# EAGLE design lupa-hdmi-carrier (EAGLE 9.0.1)

## Sheet 1 of 5: berstak
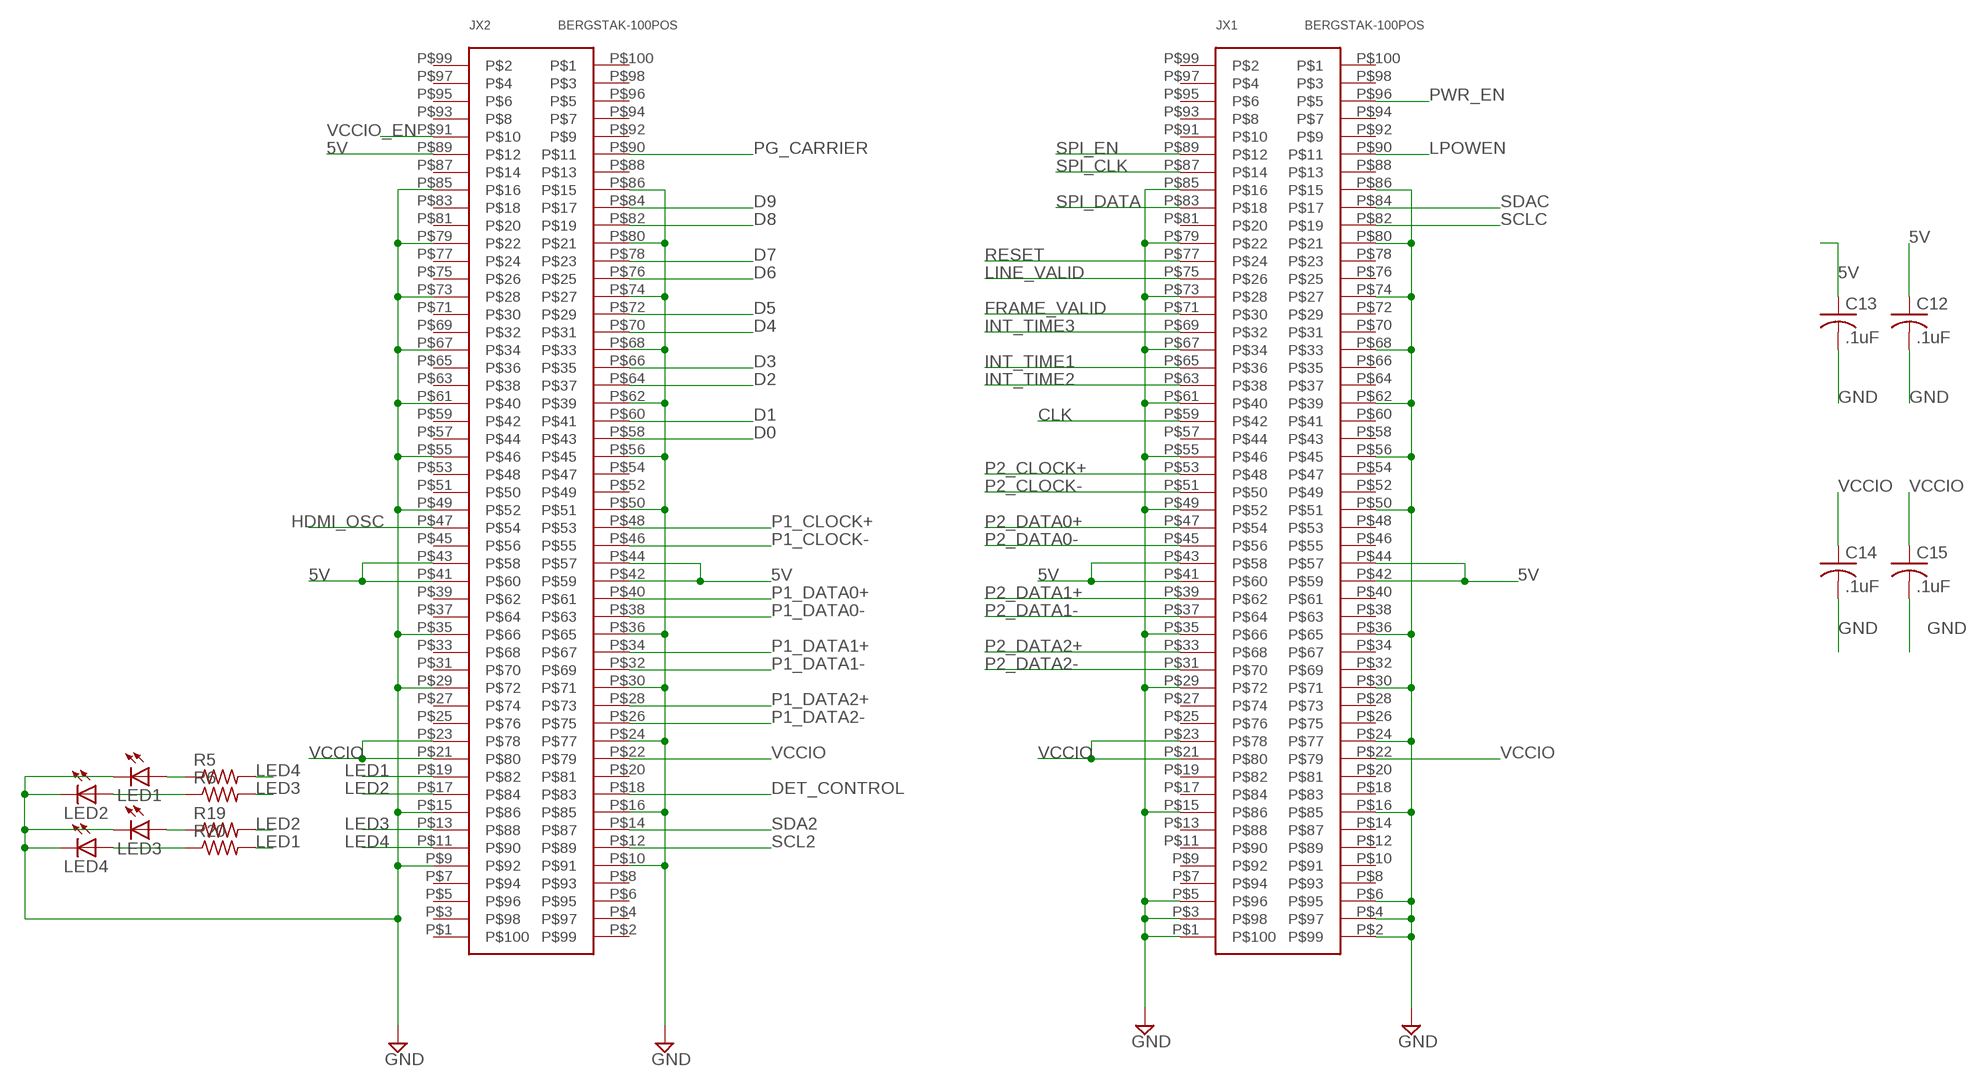
[diagram p0: schematic, sheet 1]

### Parts
C12  .1uF  C-USC0603  [C0603]
C13  .1uF  C-USC0603  [C0603]
C14  .1uF  C-USC0603  [C0603]
C15  .1uF  C-USC0603  [C0603]
JX1  BERGSTAK-100POS  [BERG100POS]
JX2  BERGSTAK-100POS  [BERG100POS]
LED1  LEDCHIPLED_0805  [CHIPLED_0805]
LED2  LEDCHIPLED_0805  [CHIPLED_0805]
LED3  LEDCHIPLED_0805  [CHIPLED_0805]
LED4  LEDCHIPLED_0805  [CHIPLED_0805]
R5  R-US_R0603  [R0603]
R6  R-US_R0603  [R0603]
R19  R-US_R0603  [R0603]
R20  R-US_R0603  [R0603]

### Nets
5V: C12.1 C13.1 JX1.P$41 JX1.P$42 JX1.P$43 JX1.P$44 JX2.P$41 JX2.P$42 JX2.P$43 JX2.P$44 JX2.P$89 ; also sheet 2,4,5
CLK: JX1.P$59 ; also sheet 3
D0: JX2.P$58 ; also sheet 3
D1: JX2.P$60 ; also sheet 3
D2: JX2.P$64 ; also sheet 3
D3: JX2.P$66 ; also sheet 3
D4: JX2.P$70 ; also sheet 3
D5: JX2.P$72 ; also sheet 3
D6: JX2.P$76 ; also sheet 3
D7: JX2.P$78 ; also sheet 3
D8: JX2.P$82 ; also sheet 3
D9: JX2.P$84 ; also sheet 3
DET_CONTROL: JX2.P$18 ; also sheet 5
FRAME_VALID: JX1.P$71 ; also sheet 3
GND: C12.2 C13.2 C14.2 C15.2 JX1.P$1 JX1.P$2 JX1.P$3 JX1.P$4 JX1.P$5 JX1.P$6 JX1.P$15 JX1.P$16 JX1.P$24 JX1.P$29 JX1.P$30 JX1.P$35 JX1.P$36 JX1.P$49 JX1.P$50 JX1.P$55 JX1.P$56 JX1.P$61 JX1.P$62 JX1.P$67 JX1.P$68 JX1.P$73 JX1.P$74 JX1.P$79 JX1.P$80 JX1.P$85 JX1.P$86 JX2.P$9 JX2.P$10 JX2.P$15 JX2.P$16 JX2.P$24 JX2.P$29 JX2.P$30 JX2.P$35 JX2.P$36 JX2.P$49 JX2.P$50 JX2.P$55 JX2.P$56 JX2.P$61 JX2.P$62 JX2.P$67 JX2.P$68 JX2.P$73 JX2.P$74 JX2.P$79 JX2.P$80 JX2.P$85 JX2.P$86 LED1.C LED2.C LED3.C LED4.C ; also sheet 2,3,4,5
HDMI_OSC: JX2.P$47 ; also sheet 5
INT_TIME1: JX1.P$65 ; also sheet 3
INT_TIME2: JX1.P$63 ; also sheet 3
INT_TIME3: JX1.P$69 ; also sheet 3
LED1: JX2.P$19 R20.2
LED2: JX2.P$17 R19.2
LED3: JX2.P$13 R6.2
LED4: JX2.P$11 R5.2
LINE_VALID: JX1.P$75 ; also sheet 3
LPOWEN: JX1.P$90 ; also sheet 4
N$3: LED1.A R5.1
N$13: LED2.A R6.1
N$15: LED3.A R19.1
N$16: LED4.A R20.1
P1_CLOCK+: JX2.P$48 ; also sheet 5
P1_CLOCK-: JX2.P$46 ; also sheet 5
P1_DATA0+: JX2.P$40 ; also sheet 5
P1_DATA0-: JX2.P$38 ; also sheet 5
P1_DATA1+: JX2.P$34 ; also sheet 5
P1_DATA1-: JX2.P$32 ; also sheet 5
P1_DATA2+: JX2.P$28 ; also sheet 5
P1_DATA2-: JX2.P$26 ; also sheet 5
P2_CLOCK+: JX1.P$53 ; also sheet 5
P2_CLOCK-: JX1.P$51 ; also sheet 5
P2_DATA0+: JX1.P$47 ; also sheet 5
P2_DATA0-: JX1.P$45 ; also sheet 5
P2_DATA1+: JX1.P$39 ; also sheet 5
P2_DATA1-: JX1.P$37 ; also sheet 5
P2_DATA2+: JX1.P$33 ; also sheet 5
P2_DATA2-: JX1.P$31 ; also sheet 5
PG_CARRIER: JX2.P$90
PWR_EN: JX1.P$96 ; also sheet 2
RESET: JX1.P$77 ; also sheet 3
SCL2: JX2.P$12 ; also sheet 5
SCLC: JX1.P$82 ; also sheet 5
SDA2: JX2.P$14 ; also sheet 5
SDAC: JX1.P$84 ; also sheet 5
SPI_CLK: JX1.P$87 ; also sheet 3
SPI_DATA: JX1.P$83 ; also sheet 3
SPI_EN: JX1.P$89 ; also sheet 3
VCCIO: C14.1 C15.1 JX1.P$21 JX1.P$22 JX1.P$23 JX2.P$21 JX2.P$22 JX2.P$23 ; also sheet 2,3,5
VCCIO_EN: JX2.P$91 ; also sheet 2
Unconnected: JX1.P$7 JX1.P$8 JX1.P$9 JX1.P$10 JX1.P$11 JX1.P$12 JX1.P$13 JX1.P$14 JX1.P$17 JX1.P$18 JX1.P$19 JX1.P$20 JX1.P$25 JX1.P$26 JX1.P$27 JX1.P$28 JX1.P$32 JX1.P$34 JX1.P$38 JX1.P$40 JX1.P$46 JX1.P$48 JX1.P$52 JX1.P$54 JX1.P$57 JX1.P$58 JX1.P$60 JX1.P$64 JX1.P$66 JX1.P$70 JX1.P$72 JX1.P$76 JX1.P$78 JX1.P$81 JX1.P$88 JX1.P$91 JX1.P$92 JX1.P$93 JX1.P$94 JX1.P$95 JX1.P$97 JX1.P$98 JX1.P$99 JX1.P$100 JX2.P$1 JX2.P$2 JX2.P$3 JX2.P$4 JX2.P$5 JX2.P$6 JX2.P$7 JX2.P$8 JX2.P$20 JX2.P$25 JX2.P$27 JX2.P$31 JX2.P$33 JX2.P$37 JX2.P$39 JX2.P$45 JX2.P$51 JX2.P$52 JX2.P$53 JX2.P$54 JX2.P$57 JX2.P$59 JX2.P$63 JX2.P$65 JX2.P$69 JX2.P$71 JX2.P$75 JX2.P$77 JX2.P$81 JX2.P$83 JX2.P$87 JX2.P$88 JX2.P$92 JX2.P$93 JX2.P$94 JX2.P$95 JX2.P$96 JX2.P$97 JX2.P$98 JX2.P$99 JX2.P$100

## Sheet 2 of 5: carrier power
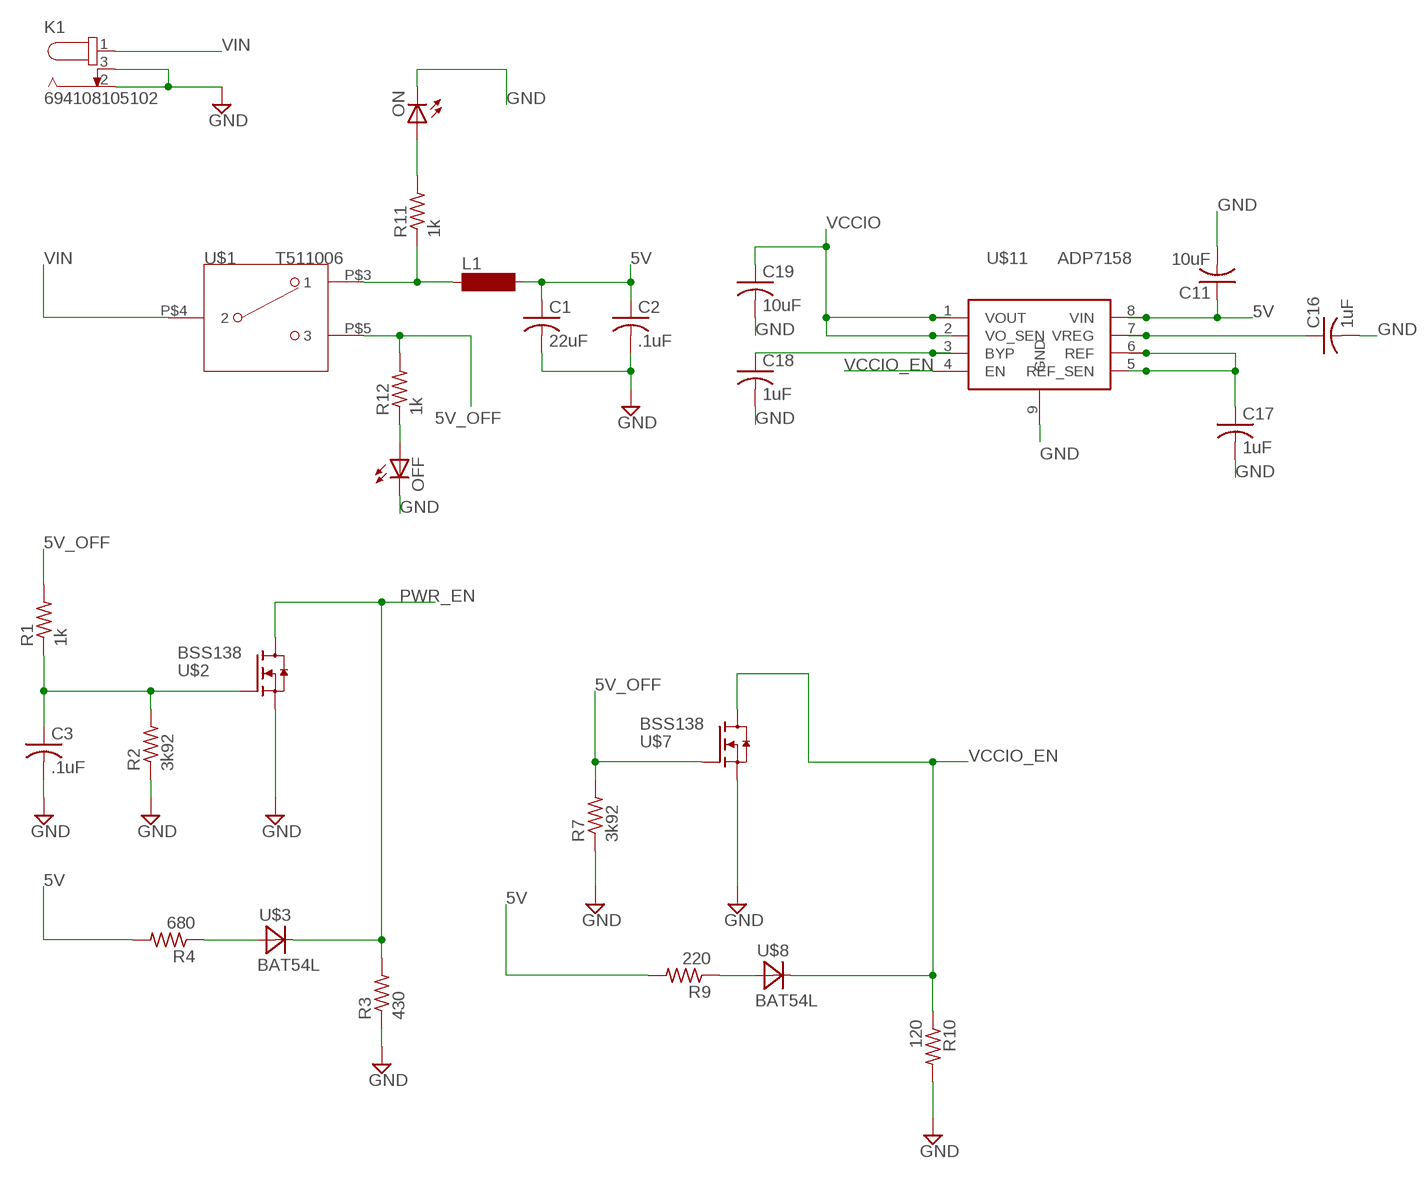
[diagram p1: schematic, sheet 2]

### Parts
C1  22uF  C-USC1206  [C1206]
C2  .1uF  C-USC0603  [C0603]
C3  .1uF  C-USC0603  [C0603]
C11  10uF  C-USC0603  [C0603]
C16  1uF  C-USC0603  [C0603]
C17  1uF  C-USC0603  [C0603]
C18  1uF  C-USC0603  [C0603]
C19  10uF  C-USC0603  [C0603]
K1  694108105102  [694108105102]
L1  MS85  [MS85]
OFF  LEDCHIPLED_0805  [CHIPLED_0805]
ON  LEDCHIPLED_0805  [CHIPLED_0805]
R1  1k  R-US_R0603  [R0603]
R2  3k92  R-US_R0603  [R0603]
R3  430  R-US_R0603  [R0603]
R4  680  R-US_R0603  [R0603]
R7  3k92  R-US_R0603  [R0603]
R9  220  R-US_R0603  [R0603]
R10  120  R-US_R0603  [R0603]
R11  1k  R-US_R0603  [R0603]
R12  1k  R-US_R0603  [R0603]
U$1  T511006  [SPDT]
U$2  BSS138  [SOT23]
U$3  BAT54L  [SOT23]
U$7  BSS138  [SOT23]
U$8  BAT54L  [SOT23]
U$11  ADP7158  [SO08]

### Nets
5V: C1.1 C2.1 C11.1 L1.2 R4.2 R9.2 U$11.8(VIN) ; also sheet 1,4,5
5V_OFF: R1.2 R7.2 R12.2 U$1.P$5 U$7.1(G)
GND: C1.2 C2.2 C3.2 C11.2 C16.2 C17.2 C18.2 C19.2 K1.2 K1.3 OFF.C ON.C R2.1 R3.1 R7.1 R10.2 U$2.2(S) U$7.2(S) U$11.9(GND) ; also sheet 1,3,4,5
N$1: C3.1 R1.1 R2.2 U$2.1(G)
N$4: R4.1 U$3.1(A)
N$5: ON.A R11.2
N$7: L1.1 R11.1 U$1.P$3
N$8: R9.1 U$8.1(A)
N$10: C16.1 U$11.7(VREG)
N$11: C17.1 U$11.5(REF_SEN) U$11.6(REF)
N$12: C18.1 U$11.3(BYP)
N$24: OFF.A R12.1
PWR_EN: R3.2 U$2.3(D) U$3.3(C) ; also sheet 1
VCCIO: C19.1 U$11.1(VOUT) U$11.2(VO_SEN) ; also sheet 1,3,5
VCCIO_EN: R10.1 U$7.3(D) U$8.3(C) U$11.4(EN) ; also sheet 1
VIN: K1.1 U$1.P$4

## Sheet 3 of 5: lupa300
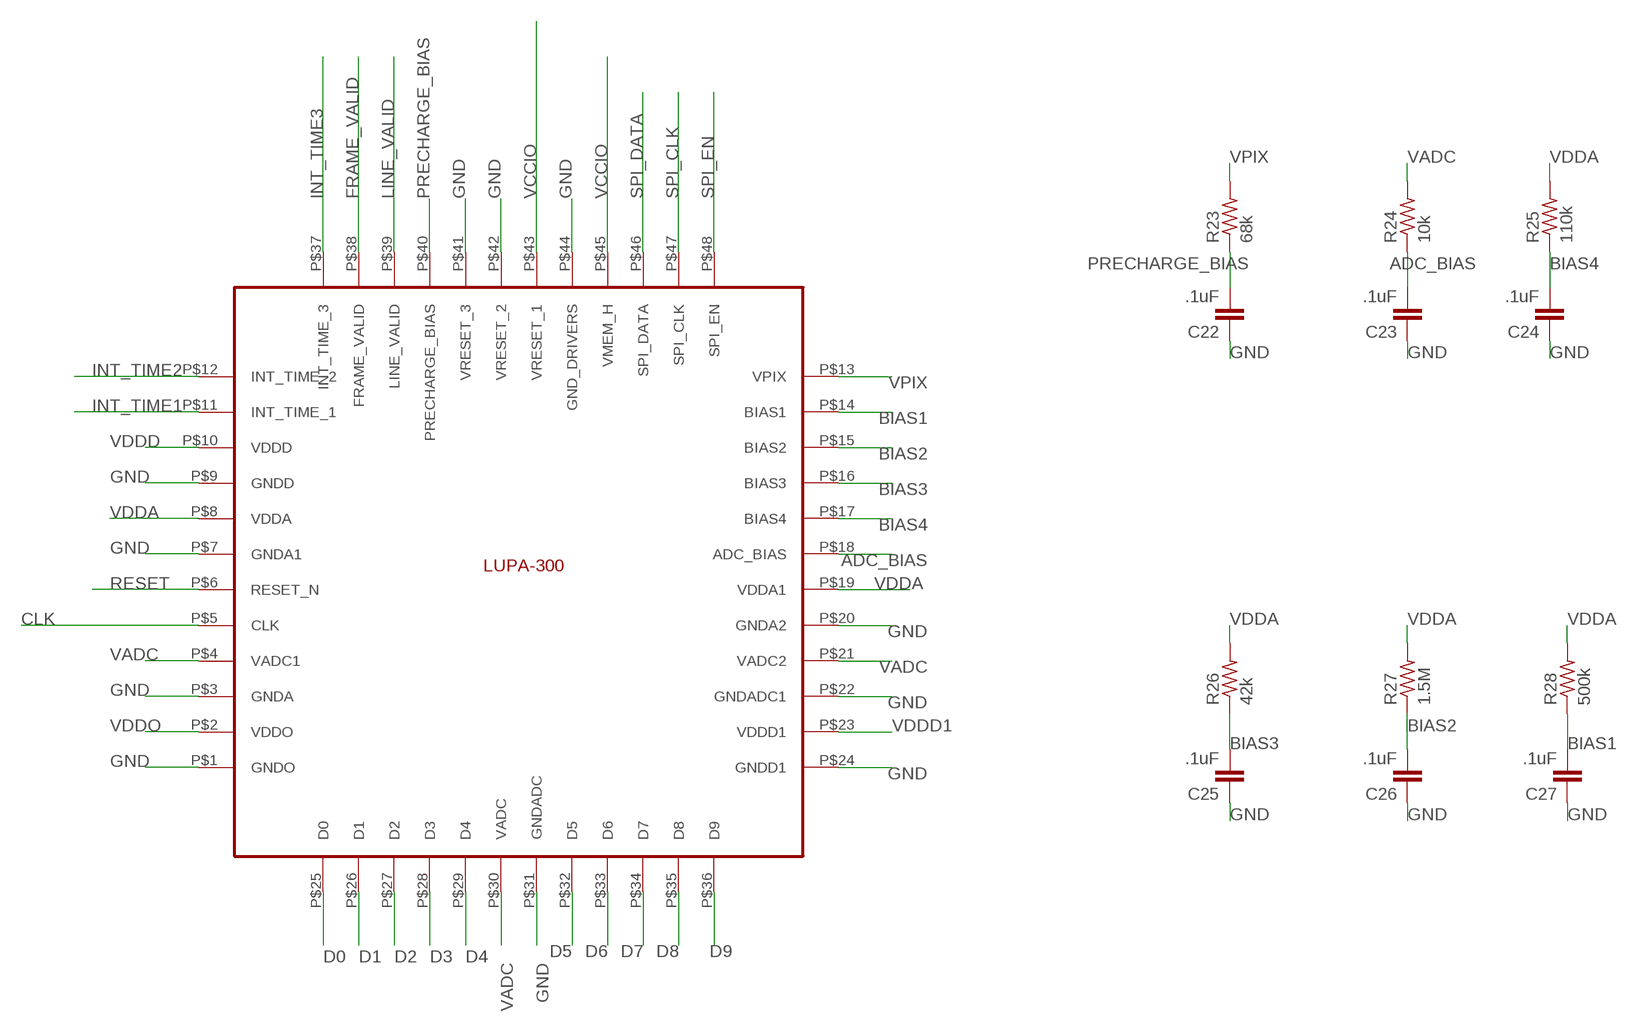
[diagram p2: schematic, sheet 3]

### Parts
C22  .1uF  C-EUC0603  [C0603]
C23  .1uF  C-EUC0603  [C0603]
C24  .1uF  C-EUC0603  [C0603]
C25  .1uF  C-EUC0603  [C0603]
C26  .1uF  C-EUC0603  [C0603]
C27  .1uF  C-EUC0603  [C0603]
R23  68k  R-US_R0603  [R0603]
R24  10k  R-US_R0603  [R0603]
R25  110k  R-US_R0603  [R0603]
R26  42k  R-US_R0603  [R0603]
R27  1.5M  R-US_R0603  [R0603]
R28  500k  R-US_R0603  [R0603]
U$4  LUPA300  [LUPA300]

### Nets
ADC_BIAS: C23.2 R24.1 U$4.P$18(ADC_BIAS)
BIAS1: C27.2 R28.1 U$4.P$14(BIAS1)
BIAS2: C26.2 R27.1 U$4.P$15(BIAS2)
BIAS3: C25.2 R26.1 U$4.P$16(BIAS3)
BIAS4: C24.2 R25.1 U$4.P$17(BIAS4)
CLK: U$4.P$5(CLK) ; also sheet 1
D0: U$4.P$25(D0) ; also sheet 1
D1: U$4.P$26(D1) ; also sheet 1
D2: U$4.P$27(D2) ; also sheet 1
D3: U$4.P$28(D3) ; also sheet 1
D4: U$4.P$29(D4) ; also sheet 1
D5: U$4.P$32(D5) ; also sheet 1
D6: U$4.P$33(D6) ; also sheet 1
D7: U$4.P$34(D7) ; also sheet 1
D8: U$4.P$35(D8) ; also sheet 1
D9: U$4.P$36(D9) ; also sheet 1
FRAME_VALID: U$4.P$38(FRAME_VALID) ; also sheet 1
GND: C22.1 C23.1 C24.1 C25.1 C26.1 C27.1 U$4.P$1(GNDO) U$4.P$3(GNDA) U$4.P$7(GNDA1) U$4.P$9(GNDD) U$4.P$20(GNDA2) U$4.P$22(GNDADC1) U$4.P$24(GNDD1) U$4.P$31(GNDADC) U$4.P$41(VRESET_3) U$4.P$42(VRESET_2) U$4.P$44(GND_DRIVERS) ; also sheet 1,2,4,5
INT_TIME1: U$4.P$11(INT_TIME_1) ; also sheet 1
INT_TIME2: U$4.P$12(INT_TIME_2) ; also sheet 1
INT_TIME3: U$4.P$37(INT_TIME_3) ; also sheet 1
LINE_VALID: U$4.P$39(LINE_VALID) ; also sheet 1
PRECHARGE_BIAS: C22.2 R23.1 U$4.P$40(PRECHARGE_BIAS)
RESET: U$4.P$6(RESET_N) ; also sheet 1
SPI_CLK: U$4.P$47(SPI_CLK) ; also sheet 1
SPI_DATA: U$4.P$46(SPI_DATA) ; also sheet 1
SPI_EN: U$4.P$48(SPI_EN) ; also sheet 1
VADC: R24.2 U$4.P$4(VADC1) U$4.P$21(VADC2) U$4.P$30(VADC) ; also sheet 4
VCCIO: U$4.P$43(VRESET_1) U$4.P$45(VMEM_H) ; also sheet 1,2,5
VDDA: R25.2 R26.2 R27.2 R28.2 U$4.P$8(VDDA) U$4.P$19(VDDA1) ; also sheet 4
VDDD: U$4.P$10(VDDD) ; also sheet 4
VDDD1: U$4.P$23(VDDD1) ; also sheet 4
VDDO: U$4.P$2(VDDO) ; also sheet 4
VPIX: R23.2 U$4.P$13(VPIX) ; also sheet 4

## Sheet 4 of 5: lupa power
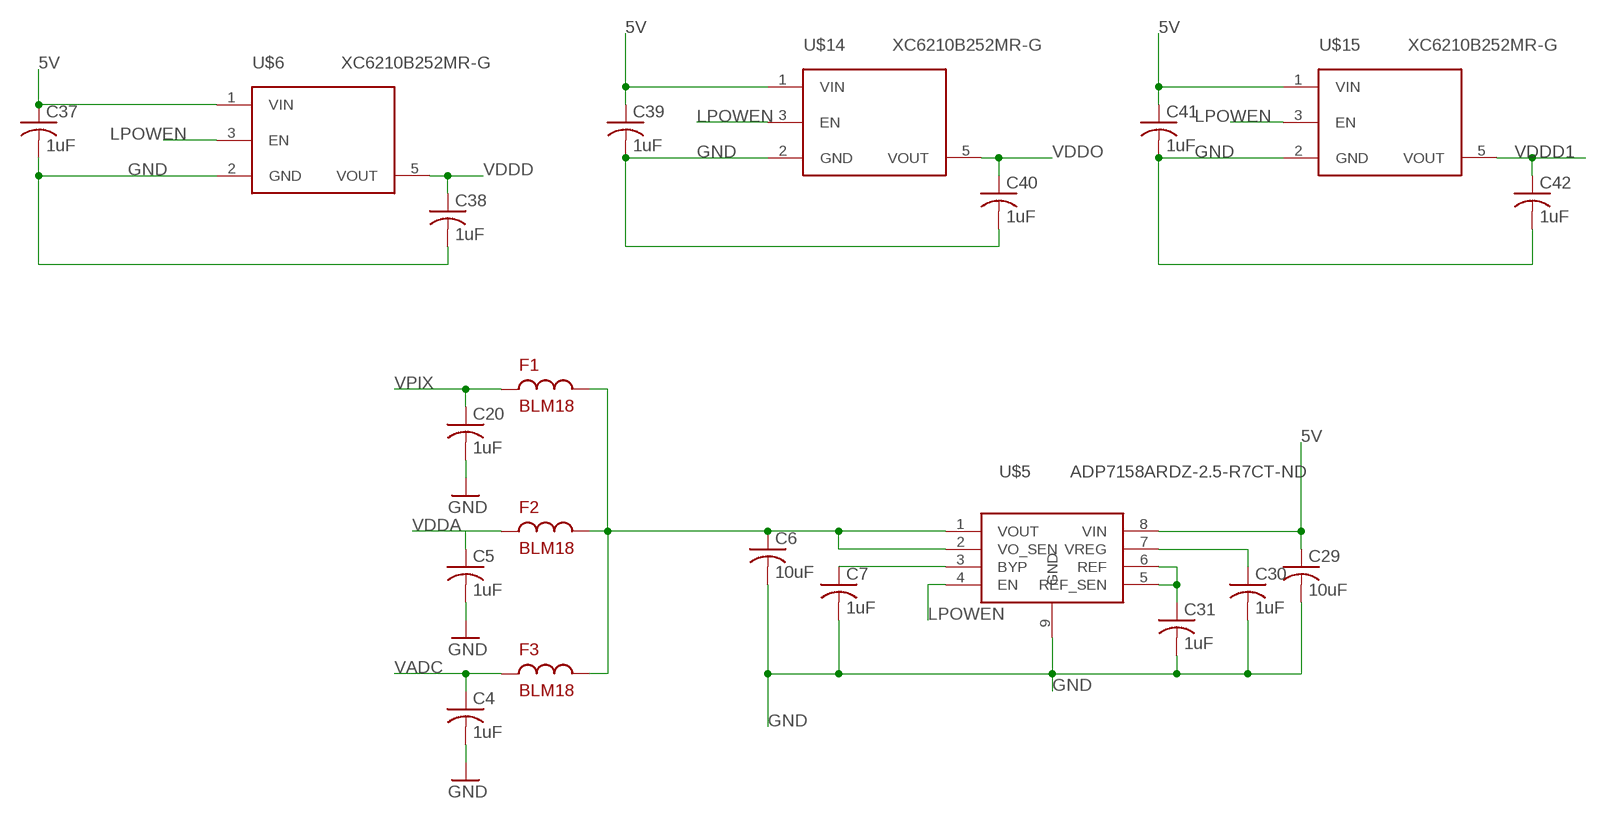
[diagram p3: schematic, sheet 4]

### Parts
C4  1uF  C-USC0603  [C0603]
C5  1uF  C-USC0603  [C0603]
C6  10uF  C-USC0603  [C0603]
C7  1uF  C-USC0603  [C0603]
C20  1uF  C-USC0603  [C0603]
C29  10uF  C-USC0603  [C0603]
C30  1uF  C-USC0603  [C0603]
C31  1uF  C-USC0603  [C0603]
C37  1uF  C-USC0603  [C0603]
C38  1uF  C-USC0603  [C0603]
C39  1uF  C-USC0603  [C0603]
C40  1uF  C-USC0603  [C0603]
C41  1uF  C-USC0603  [C0603]
C42  1uF  C-USC0603  [C0603]
F1  BLM18  [C0603K]
F2  BLM18  [C0603K]
F3  BLM18  [C0603K]
U$5  ADP7158ARDZ-2.5-R7CT-ND  [SO08]
U$6  XC6210B252MR-G  [SOT25]
U$14  XC6210B252MR-G  [SOT25]
U$15  XC6210B252MR-G  [SOT25]

### Nets
5V: C29.1 C37.1 C39.1 C41.1 U$5.8(VIN) U$6.1(VIN) U$14.1(VIN) U$15.1(VIN) ; also sheet 1,2,5
GND: C4.2 C5.2 C6.2 C7.2 C20.2 C29.2 C30.2 C31.2 C37.2 C38.2 C39.2 C40.2 C41.2 C42.2 U$5.9(GND) U$6.2(GND) U$14.2(GND) U$15.2(GND) ; also sheet 1,2,3,5
LPOWEN: U$5.4(EN) U$6.3(EN) U$14.3(EN) U$15.3(EN) ; also sheet 1
N$2: C6.1 F1.2 F2.2 F3.2 U$5.1(VOUT) U$5.2(VO_SEN)
N$14: C7.1 U$5.3(BYP)
N$22: C30.1 U$5.7(VREG)
N$23: C31.1 U$5.5(REF_SEN) U$5.6(REF)
VADC: C4.1 F3.1 ; also sheet 3
VDDA: C5.1 F2.1 ; also sheet 3
VDDD: C38.1 U$6.5(VOUT) ; also sheet 3
VDDD1: C42.1 U$15.5(VOUT) ; also sheet 3
VDDO: C40.1 U$14.5(VOUT) ; also sheet 3
VPIX: C20.1 F1.1 ; also sheet 3

## Sheet 5 of 5: HDMI connectors
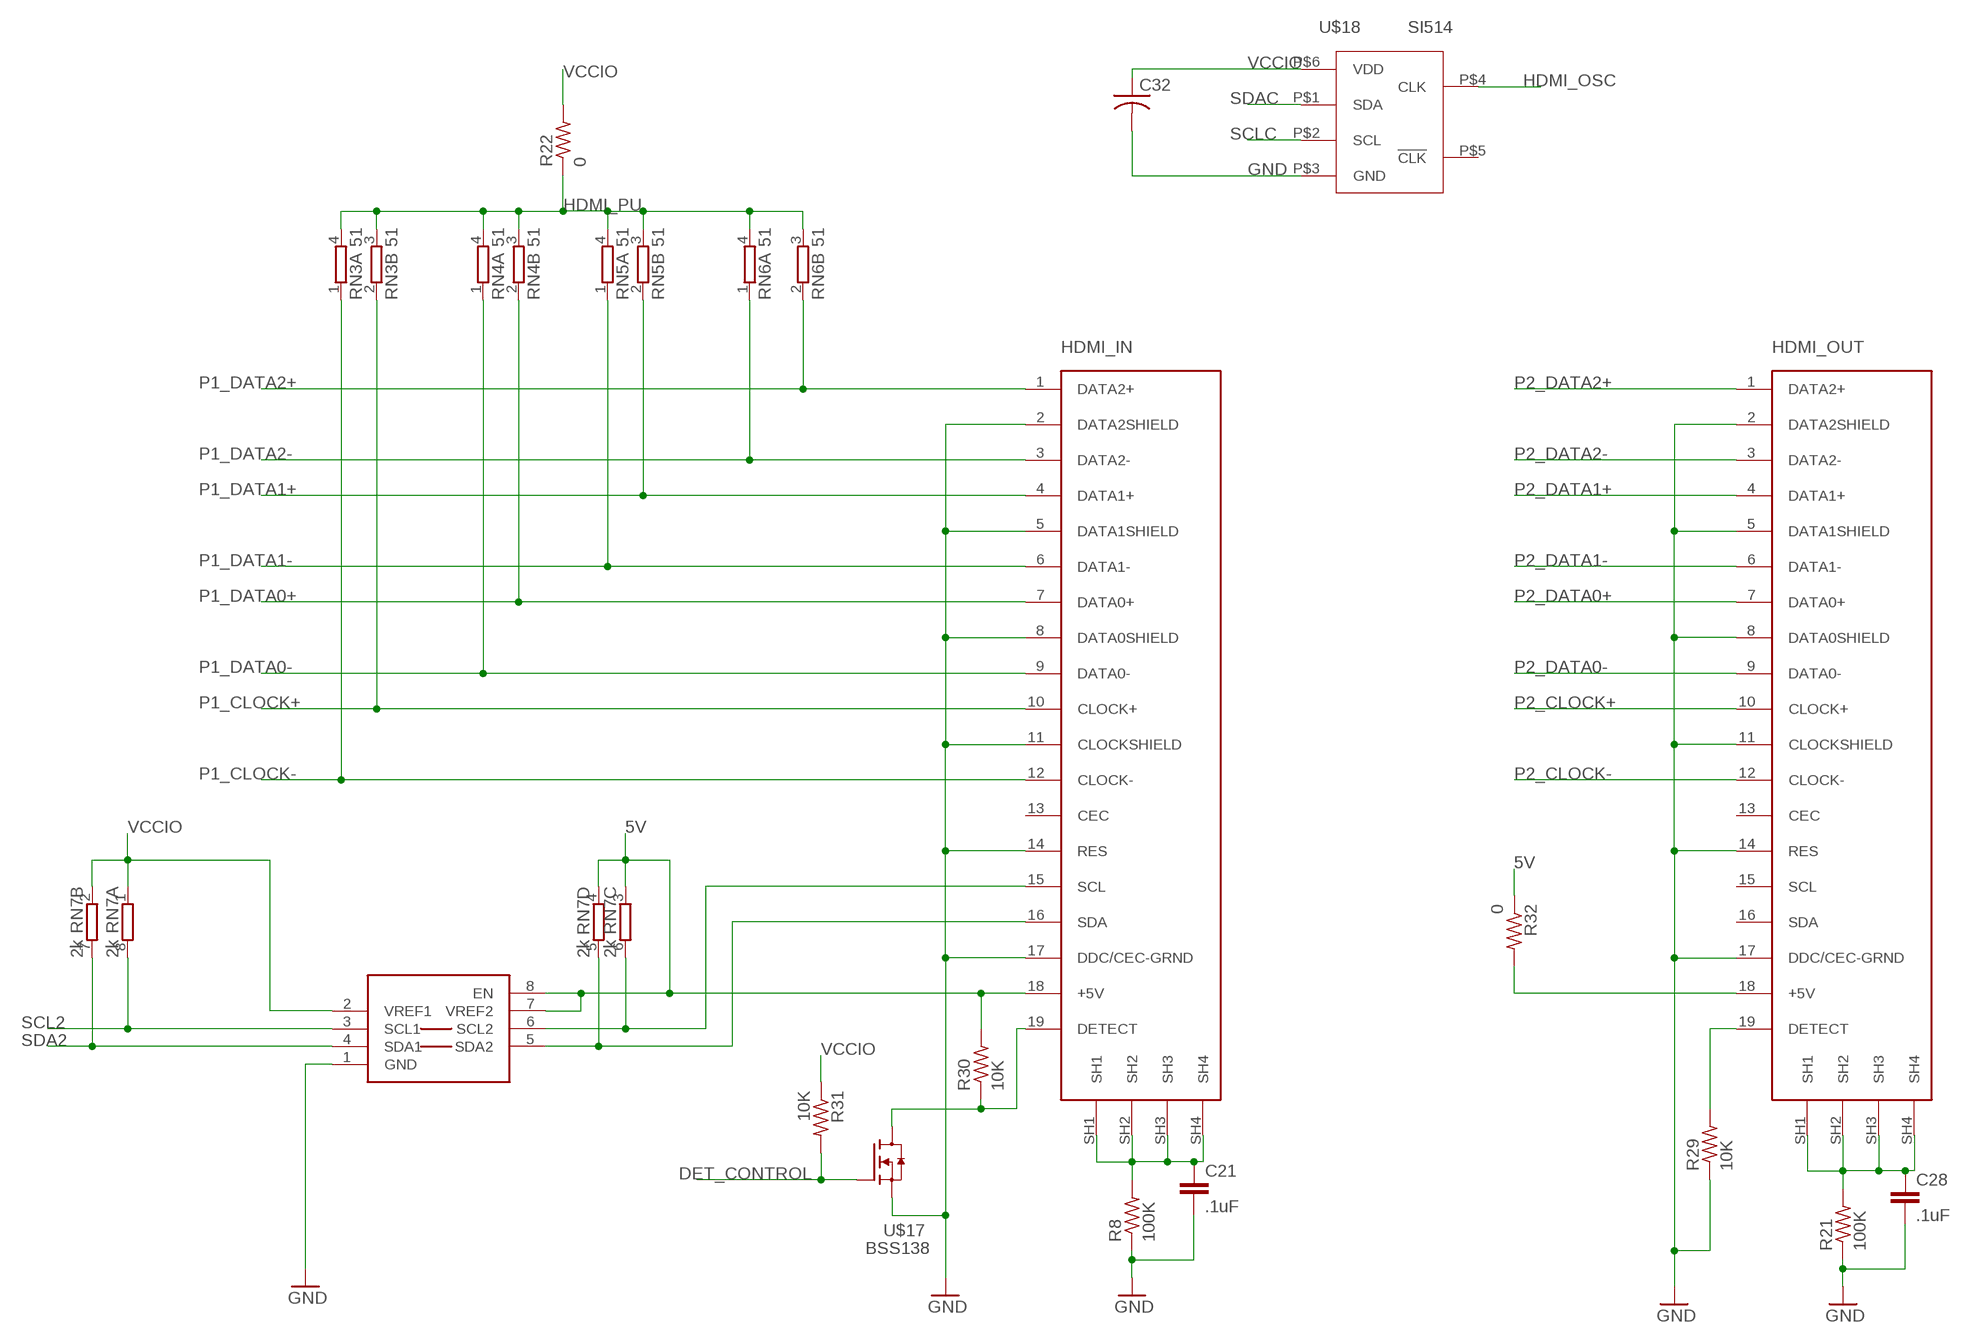
[diagram p4: schematic, sheet 5]

### Parts
C21  .1uF  C-EUC0603K  [C0603K]
C28  .1uF  C-EUC0603K  [C0603K]
C32  C-USC0603  [C0603]
HDMI_IN  HDMI-TYPE-A-RECEPTICALFCI10029449  [FCI-HDMI-TYPE-A-RECEPT]
HDMI_OUT  HDMI-TYPE-A-RECEPTICALFCI10029449  [FCI-HDMI-TYPE-A-RECEPT]
PCA9306  PCA9306  [PSOP-8]
R8  100K  R-US_R0603  [R0603]
R21  100K  R-US_R0603  [R0603]
R22  0  R-US_R0603  [R0603]
R29  10K  R-US_R0603  [R0603]
R30  10K  R-US_R0603  [R0603]
R31  10K  R-US_R0603  [R0603]
R32  0  R-US_R0603  [R0603]
RN3  51  2R-NEXB34V  [EXB34V]
RN4  51  2R-NEXB34V  [EXB34V]
RN5  51  2R-NEXB34V  [EXB34V]
RN6  51  2R-NEXB34V  [EXB34V]
RN7  2k  4R-N0603-ARV  [0603-ARV]
U$17  BSS138  [SOT23]
U$18  SI514  [XTAL-6PIN]

### Nets
5V: HDMI_IN.18(+5V) PCA9306.7(VREF2) PCA9306.8(EN) R30.2 R32.1 RN7.3 RN7.4 ; also sheet 1,2,4
DET_CONTROL: R31.2 U$17.1(G) ; also sheet 1
GND: C21.2 C28.2 C32.2 HDMI_IN.2(DATA2SHIELD) HDMI_IN.5(DATA1SHIELD) HDMI_IN.8(DATA0SHIELD) HDMI_IN.11(CLOCKSHIELD) HDMI_IN.14(RES) HDMI_IN.17(DDC/CEC-GRND) HDMI_OUT.2(DATA2SHIELD) HDMI_OUT.5(DATA1SHIELD) HDMI_OUT.8(DATA0SHIELD) HDMI_OUT.11(CLOCKSHIELD) HDMI_OUT.14(RES) HDMI_OUT.17(DDC/CEC-GRND) PCA9306.1(GND) R8.1 R21.1 R29.1 U$17.2(S) U$18.P$3(GND) ; also sheet 1,2,3,4
HDMI_OSC: U$18.P$4(CLK) ; also sheet 1
HDMI_PU: R22.1 RN3.3 RN3.4 RN4.3 RN4.4 RN5.3 RN5.4 RN6.3 RN6.4
N$6: C28.1 HDMI_OUT.SH1 HDMI_OUT.SH2 HDMI_OUT.SH3 HDMI_OUT.SH4 R21.2
N$17: HDMI_OUT.19(DETECT) R29.2
N$18: HDMI_IN.19(DETECT) R30.1 U$17.3(D)
N$19: HDMI_IN.16(SDA) PCA9306.5(SDA2) RN7.5
N$20: HDMI_IN.15(SCL) PCA9306.6(SCL2) RN7.6
N$21: HDMI_OUT.18(+5V) R32.2
N$34: C21.1 HDMI_IN.SH1 HDMI_IN.SH2 HDMI_IN.SH3 HDMI_IN.SH4 R8.2
P1_CLOCK+: HDMI_IN.10(CLOCK+) RN3.2 ; also sheet 1
P1_CLOCK-: HDMI_IN.12(CLOCK-) RN3.1 ; also sheet 1
P1_DATA0+: HDMI_IN.7(DATA0+) RN4.2 ; also sheet 1
P1_DATA0-: HDMI_IN.9(DATA0-) RN4.1 ; also sheet 1
P1_DATA1+: HDMI_IN.4(DATA1+) RN5.2 ; also sheet 1
P1_DATA1-: HDMI_IN.6(DATA1-) RN5.1 ; also sheet 1
P1_DATA2+: HDMI_IN.1(DATA2+) RN6.2 ; also sheet 1
P1_DATA2-: HDMI_IN.3(DATA2-) RN6.1 ; also sheet 1
P2_CLOCK+: HDMI_OUT.10(CLOCK+) ; also sheet 1
P2_CLOCK-: HDMI_OUT.12(CLOCK-) ; also sheet 1
P2_DATA0+: HDMI_OUT.7(DATA0+) ; also sheet 1
P2_DATA0-: HDMI_OUT.9(DATA0-) ; also sheet 1
P2_DATA1+: HDMI_OUT.4(DATA1+) ; also sheet 1
P2_DATA1-: HDMI_OUT.6(DATA1-) ; also sheet 1
P2_DATA2+: HDMI_OUT.1(DATA2+) ; also sheet 1
P2_DATA2-: HDMI_OUT.3(DATA2-) ; also sheet 1
SCL2: PCA9306.3(SCL1) RN7.8 ; also sheet 1
SCLC: U$18.P$2(SCL) ; also sheet 1
SDA2: PCA9306.4(SDA1) RN7.7 ; also sheet 1
SDAC: U$18.P$1(SDA) ; also sheet 1
VCCIO: C32.1 PCA9306.2(VREF1) R22.2 R31.1 RN7.1 RN7.2 U$18.P$6(VDD) ; also sheet 1,2,3
Unconnected: HDMI_IN.13(CEC) HDMI_OUT.13(CEC) HDMI_OUT.15(SCL) HDMI_OUT.16(SDA) U$18.P$5(!CLK)

## Library data of the parts
C1-C7 C11-C20 C29-C32 C37-C42 = rcl:C-US: CAPACITOR, American symbol; SPICEPREFIX: C
C21 C28 = rcl:C-EU: CAPACITOR, European symbol
C22-C27 = rcl:C-EU: CAPACITOR, European symbol; SPICEPREFIX: C
F1-F3 = lupa300-components:BLM18: FERRITE BEAD 120 OHM 0603 1LN
HDMI_IN HDMI_OUT = saanlima:HDMI-TYPE-A-RECEPTICAL
JX1 JX2 = lupa300-components:BERGSTAK-100POS
K1 = Wurth_Elektronik_Electromechanic_DC_Power_Jack_Connectors_rev15c:694108105102: WR-DC_DC Power Jack_Right Angled_SMT Center Pin Ø2.5_Plug ID Ø2.55_Plug OD Ø5.5_with Peg ;=>Code : Con_WR-DC_SMT_694106105102_694108105102 <http://katalog.we-online.de/media/images/eican/Con_WR-DC_SMT_694106105102_pf2.jpg> Details see: http://katalog.we-online.de/em/datasheet/6941xx105102.pdf Created 2014-10-08, Karrer Zheng 2014 (C) Wurth Elektronik
L1 = inductor-neosid:MS85: INDUCTOR SMD power inductor; OC_FARNELL: unknown; OC_NEWARK: unknown
LED1-LED4 = led:LED: LED
OFF ON = adafruit:LED: LED
PCA9306 = saanlima:PCA9306
R1-R4 R7 R9-R12 R22-R28 = rcl:R-US_: RESISTOR, American symbol; SPICEPREFIX: R
R5 R6 R19 R20 = resistor:R-US_: RESISTOR, American symbol
R8 R21 R29-R32 = rcl:R-US_: RESISTOR, American symbol
RN3-RN6 = resistor-dil:2R-N: Array Chip Resistor Source: Panasonic; OC_FARNELL: unknown; OC_NEWARK: unknown
RN7 = resistor-dil:4R-N: Array Chip Resistor Source: RS Component / Phycomp; OC_FARNELL: unknown; OC_NEWARK: unknown
U$1 = lupa300-components:T511006: Slide Switch SPDT Through Hole, Right Angle
U$2 U$7 U$17 = lupa300-components:BSS138: N-Channel 50V 220mA (Ta) 360mW (Ta) Surface Mount SOT-23-3
U$3 U$8 = lupa300-components:BAT54L: Diode Schottky 30V 200mA (DC) Surface Mount SOT-23-3 (TO-236)
U$4 = andon:LUPA300
U$5 = lupa300-components:ADP7158ARDZ-2.5-R7CT-ND: Linear Voltage Regulator IC Positive Fixed 1 Output 2.5V 2A 8-SOIC-EP
U$6 U$14 U$15 = lupa300-components:XC6210B252MR-G: Linear Voltage Regulator IC Positive Fixed 1 Output 2.5V 700mA SOT-25
U$11 = lupa300-components:ADP7158: Linear Voltage Regulator IC Positive Fixed 1 Output 3.3V 2A 8-SOIC-EP
U$18 = lupa300-components:SI514

## Board
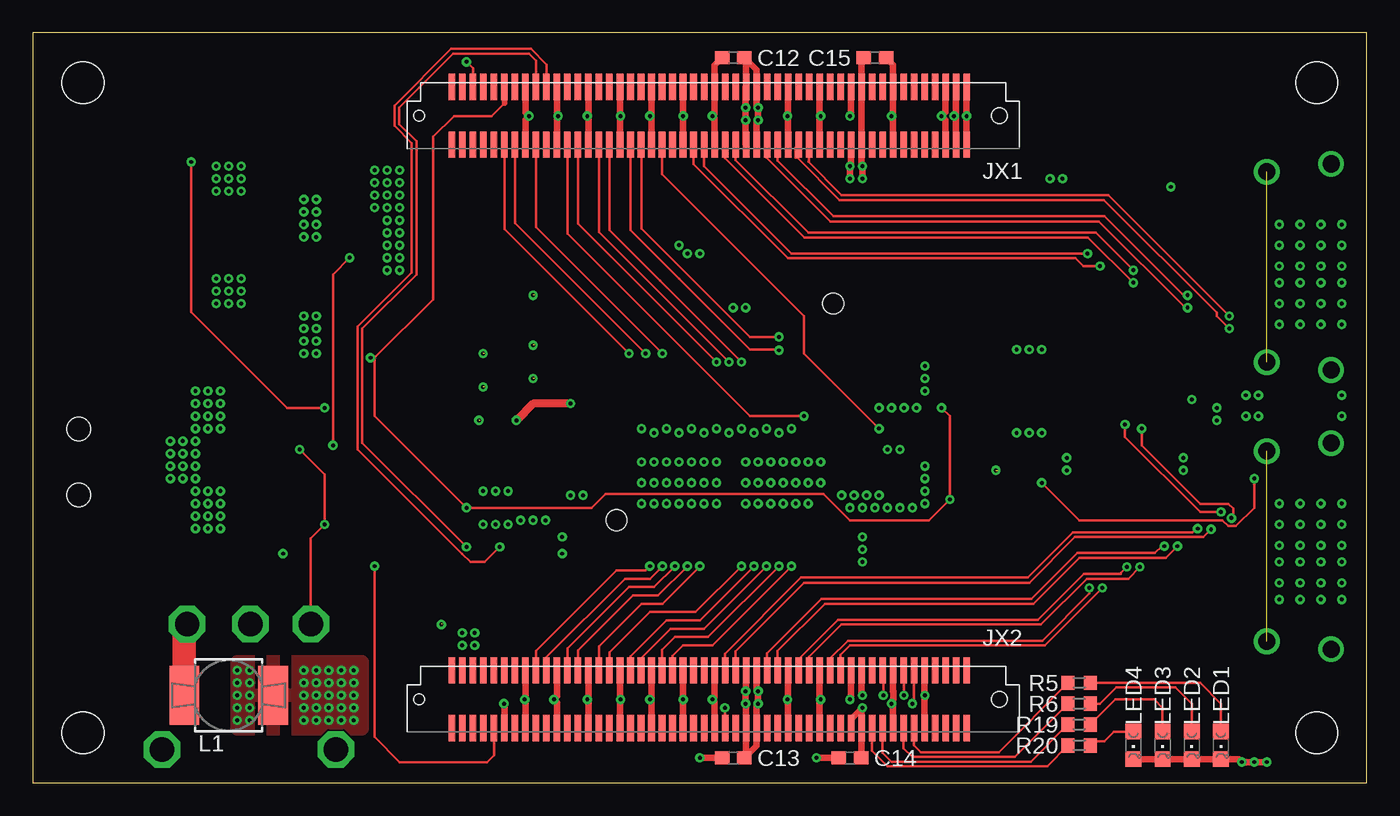
[diagram p5: board, top side]
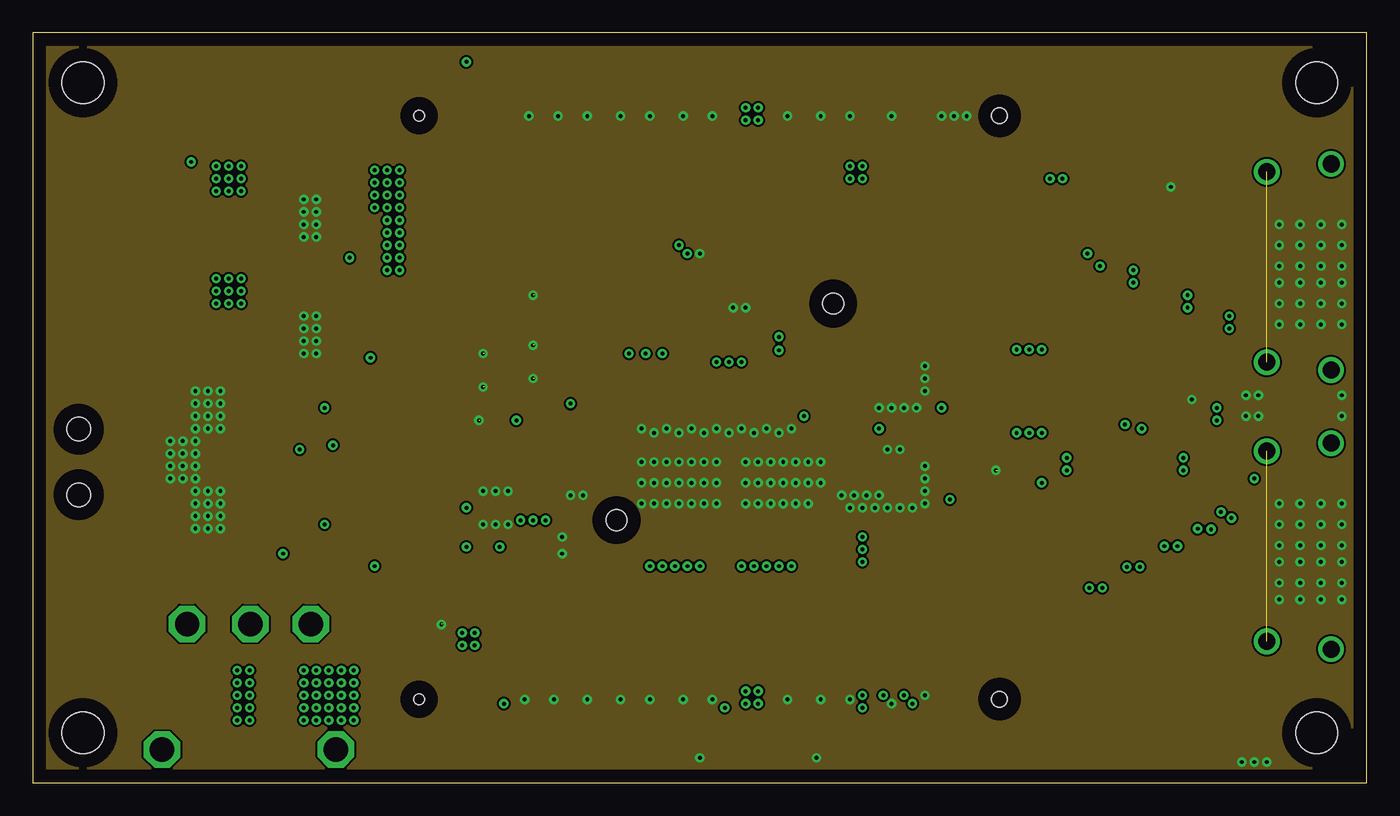
[diagram p6: board, inner layer Route2]
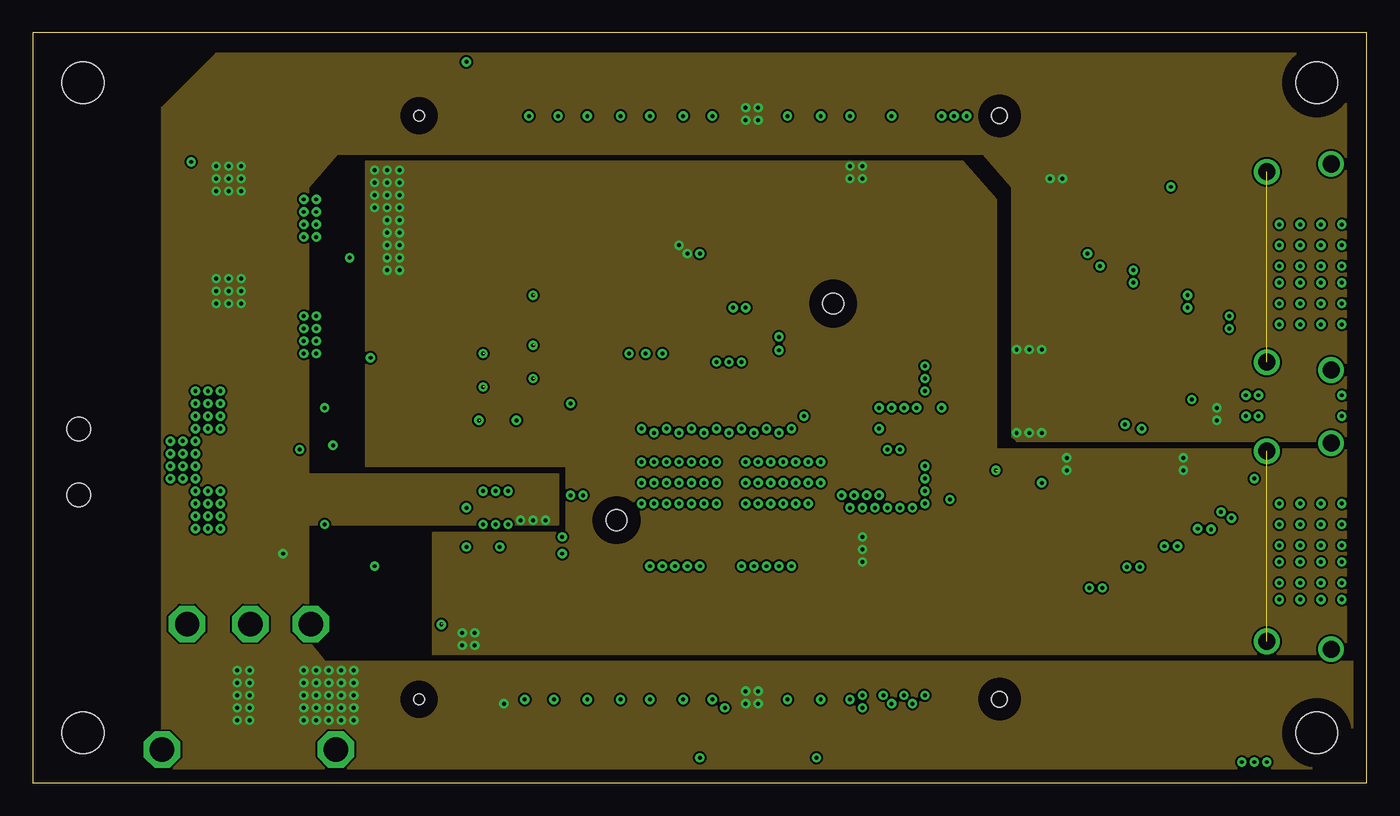
[diagram p7: board, inner layer Route15]
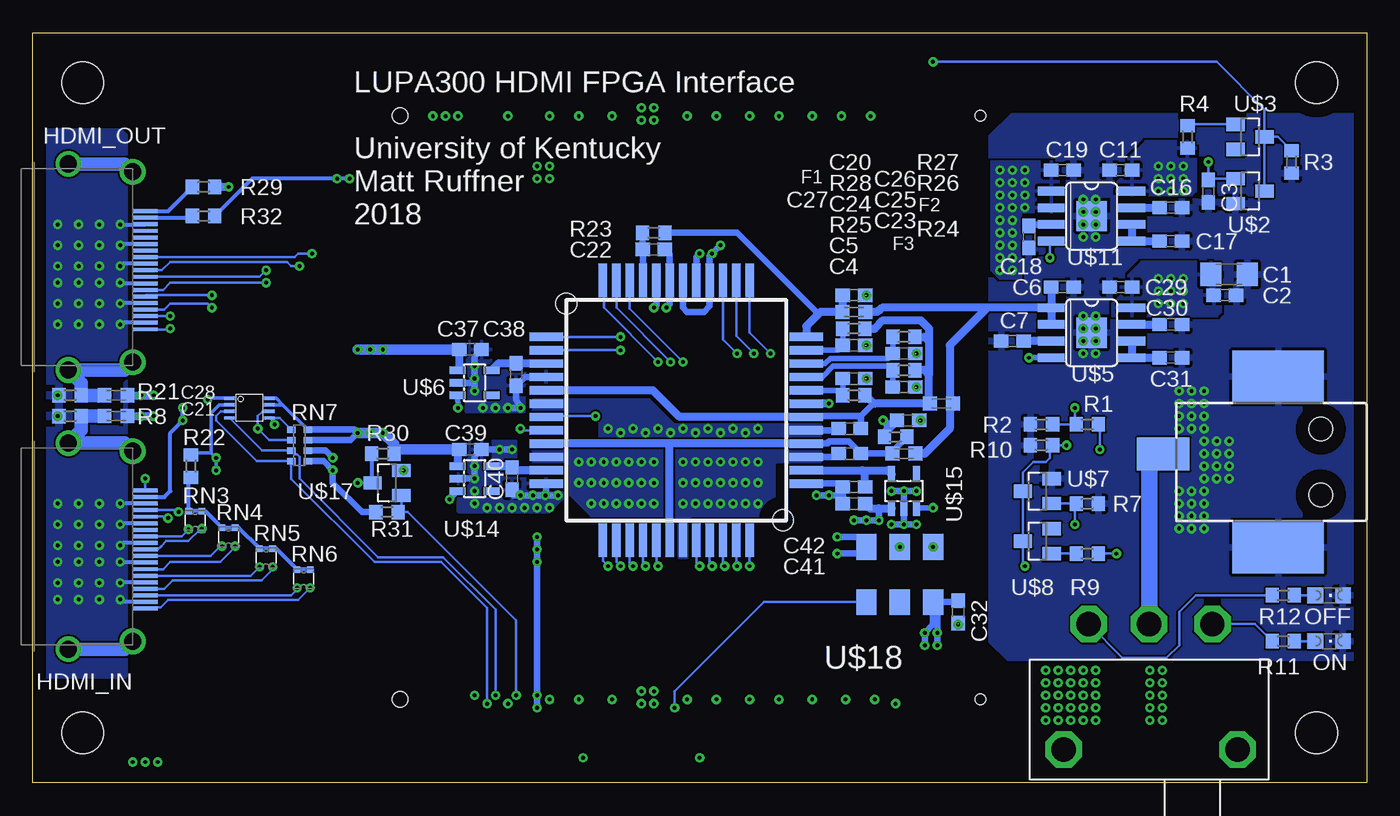
[diagram p8: board, bottom side, seen from below]

Size 101.59 x 57.14 mm. Coordinates in mm from the lower left corner, seen from the top.
Outline: 0,0 101.59,0 101.59,57.14 0,57.14 0,0
Copper layers (1+2*15+16): Top 0.035mm / dielectric 1.5mm / Route2 0.035mm / dielectric 0.15mm / Route15 0.035mm / dielectric 0.2mm / Bottom 0.035mm
Design rules "default *": minimum track width 6mil, minimum drill 0.35mm, track to track 6mil, track to pad 6mil, pad to pad 6mil, via to via 6mil, smd to smd 6mil, copper to edge 40mil, drill to drill 6mil, minimum pad ring 10mil, minimum via ring 8mil, stop-mask expansion 4mil, vias tented up to drill 12mil, thermal gap 10mil
Holes 3.2 mm at 3.81,53.34 3.81,3.81 97.79,53.34 97.79,3.81

### Footprints (pad centres in the part's own frame; a part is rotated, then mirrored left to right if it is on the bottom)
C1206 = smd 1.6 x 1.8: 1 -1.4,0; 2 1.4,0
C0603 = smd 1.1 x 1: 1 -0.85,0; 2 0.85,0
C0603K = smd 1.05 x 1.08: 1 -0.875,0; 2 0.875,0
FCI-HDMI-TYPE-A-RECEPT = smd 1.9 x 0.3: 1 -0.95,4.5; 2 -0.95,4; 3 -0.95,3.5; 4 -0.95,3; 5 -0.95,2.5; 6 -0.95,2; 7 -0.95,1.5; 8 -0.95,1; 9 -0.95,0.5; 10 -0.95,0; 11 -0.95,-0.5; 12 -0.95,-1; 13 -0.95,-1.5; 14 -0.95,-2; 15 -0.95,-2.5; 16 -0.95,-3; 17 -0.95,-3.5; 18 -0.95,-4; 19 -0.95,-4.5 | drill 1.3: SH1 4.9,7.6; SH2 0,7; SH3 0,-7.5; SH4 4.9,-8.1
BERG100POS = smd 0.5 x 2: P$1 0,1; P$2 0,5.4; P$3 -0.8,1; P$4 -0.8,5.4; P$5 -1.6,1; P$6 -1.6,5.4; P$7 -2.4,1; P$8 -2.4,5.4; P$9 -3.2,1; P$10 -3.2,5.4; P$11 -4,1; P$12 -4,5.4; P$13 -4.8,1; P$14 -4.8,5.4; P$15 -5.6,1; P$16 -5.6,5.4; P$17 -6.4,1; P$18 -6.4,5.4; P$19 -7.2,1; P$20 -7.2,5.4; P$21 -8,1; P$22 -8,5.4; P$23 -8.8,1; P$24 -8.8,5.4; P$25 -9.6,1; P$26 -9.6,5.4; P$27 -10.4,1; P$28 -10.4,5.4; P$29 -11.2,1; P$30 -11.2,5.4; P$31 -12,1; P$32 -12,5.4; P$33 -12.8,1; P$34 -12.8,5.4; P$35 -13.6,1; P$36 -13.6,5.4; P$37 -14.4,1; P$38 -14.4,5.4; P$39 -15.2,1; P$40 -15.2,5.4; P$41 -16,1; P$42 -16,5.4; P$43 -16.8,1; P$44 -16.8,5.4; P$45 -17.6,1; P$46 -17.6,5.4; P$47 -18.4,1; P$48 -18.4,5.4; P$49 -19.2,1; P$50 -19.2,5.4; P$51 -20,1; P$52 -20,5.4; P$53 -20.8,1; P$54 -20.8,5.4; P$55 -21.6,1; P$56 -21.6,5.4; P$57 -22.4,1; P$58 -22.4,5.4; P$59 -23.2,1; P$60 -23.2,5.4; P$61 -24,1; P$62 -24,5.4; P$63 -24.8,1; P$64 -24.8,5.4; P$65 -25.6,1; P$66 -25.6,5.4; P$67 -26.4,1; P$68 -26.4,5.4; P$69 -27.2,1; P$70 -27.2,5.4; P$71 -28,1; P$72 -28,5.4; P$73 -28.8,1; P$74 -28.8,5.4; P$75 -29.6,1; P$76 -29.6,5.4; P$77 -30.4,1; P$78 -30.4,5.4; P$79 -31.2,1; P$80 -31.2,5.4; P$81 -32,1; P$82 -32,5.4; P$83 -32.8,1; P$84 -32.8,5.4; P$85 -33.6,1; P$86 -33.6,5.4; P$87 -34.4,1; P$88 -34.4,5.4; P$89 -35.2,1; P$90 -35.2,5.4; P$91 -36,1; P$92 -36,5.4; P$93 -36.8,1; P$94 -36.8,5.4; P$95 -37.6,1; P$96 -37.6,5.4; P$97 -38.4,1; P$98 -38.4,5.4; P$99 -39.2,1; P$100 -39.2,5.4 | hole 0.8: -41.7,3.2 | hole 1.2: 2.5,3.2
694108105102 = smd 4 x 2.5: 1 15.5,-0.6 | smd 7 x 4: 2 6.75,6.5; 3 6.75,-6.5 | hole 1.8: 3.5,2.5; 3.5,-2.5
MS85 = smd 4.5 x 2.25: 1 0,-3.383; 2 0,3.383
CHIPLED_0805 = smd 1.2 x 1.2: A 0,-1.05; C 0,1.05
PSOP-8 = smd 0.25 x 0.8: 1 -0.73,-1.52; 2 -0.23,-1.52; 3 0.27,-1.52; 4 0.77,-1.52; 5 0.77,1.53; 6 0.27,1.53; 7 -0.23,1.53; 8 -0.73,1.53
R0603 = smd 1 x 1.1: 1 -0.85,0; 2 0.85,0
EXB34V = smd 0.5 x 0.5: 1 -0.5,-0.7; 2 0.5,-0.7; 3 0.5,0.7; 4 -0.5,0.7
0603-ARV = smd 0.5 x 0.65: 1 -1.2,-0.625; 2 -0.4,-0.625; 3 0.4,-0.625; 4 1.2,-0.625; 5 1.2,0.625; 6 0.4,0.625; 7 -0.4,0.625; 8 -1.2,0.625
SPDT = drill 1.85 octagon: P$1 1.27,11.43; P$2 14.51,11.42; P$3 3.18,1.87; P$4 7.99,1.87; P$5 12.6,1.87
SOT23 = smd 1 x 1.4: 1 -0.95,-1.1; 2 0.95,-1.1; 3 0,1.1
LUPA300 = smd 2.54 x 0.635: P$1 -2.794,1.524; P$2 -2.794,2.54; P$3 -2.794,3.556; P$4 -2.794,4.572; P$5 -2.794,5.588; P$6 -2.794,6.604; P$7 -2.794,7.62; P$8 -2.794,8.636; P$9 -2.794,9.652; P$10 -2.794,10.668; P$11 -2.794,11.684; P$12 -2.794,12.7; P$13 17.018,12.7; P$14 17.018,11.684; P$15 17.018,10.668; P$16 17.018,9.652; P$17 17.018,8.636; P$18 17.018,7.62; P$19 17.018,6.604; P$20 17.018,5.588; P$21 17.018,4.572; P$22 17.018,3.556; P$23 17.018,2.54; P$24 17.018,1.524 | smd 0.635 x 2.54: P$25 1.524,-2.794; P$26 2.54,-2.794; P$27 3.556,-2.794; P$28 4.572,-2.794; P$29 5.588,-2.794; P$30 6.604,-2.794; P$31 7.62,-2.794; P$32 8.636,-2.794; P$33 9.652,-2.794; P$34 10.668,-2.794; P$35 11.684,-2.794; P$36 12.7,-2.794; P$37 1.524,17.018; P$38 2.54,17.018; P$39 3.556,17.018; P$40 4.572,17.018; P$41 5.588,17.018; P$42 6.604,17.018; P$43 7.62,17.018; P$44 8.636,17.018; P$45 9.652,17.018; P$46 10.668,17.018; P$47 11.684,17.018; P$48 12.7,17.018 | hole 1.6: -1.27,15.24; 15.24,-1.27
SO08 = smd 0.66 x 2.032: 1 -1.905,-3.073; 2 -0.635,-3.073; 3 0.635,-3.073; 4 1.905,-3.073; 5 1.905,3.073; 6 0.635,3.073; 7 -0.635,3.073; 8 -1.905,3.073 | smd 2.311 x 2.311: 9 0,0
SOT25 = smd 0.55 x 1.2: 1 -0.95,-1.3; 2 0,-1.3; 3 0.95,-1.3; 4 0.95,1.3; 5 -0.95,1.3
XTAL-6PIN = smd 1.95 x 1.55: P$1 -2.1,2.54; P$2 -2.1,0; P$3 -2.1,-2.54; P$4 2.1,-2.54; P$5 2.1,0; P$6 2.1,2.54

### Placement (x,y rotation side)
C1  10.48,38.73 0 bottom
C2  10.79,37.15 0 bottom
C3  12.06,45.09 270 bottom
C4  39.37,25.08 180 bottom
C5  39.37,26.99 180 bottom
C6  23.18,37.78 0 bottom
C7  26.99,33.66 180 bottom
C11  18.73,46.67 180 bottom
C12  53.34,55.24 180 top
C13  53.34,1.91 180 top
C14  62.23,1.91 180 top
C15  64.14,55.24 0 top
C16  14.92,43.81 0 bottom
C17  14.92,41.27 0 bottom
C18  25.72,41.59 270 bottom
C19  23.18,46.67 0 bottom
C20  39.05,37.15 0 bottom
C21  95.25,27.94 0 bottom
C22  54.29,40.64 180 bottom
C23  34.92,27.62 180 bottom
C24  39.05,30.8 180 bottom
C25  35.24,30.16 180 bottom
C26  35.24,32.7 180 bottom
C27  39.05,33.34 180 bottom
C28  95.25,29.53 0 bottom
C29  18.73,37.78 180 bottom
C30  14.92,34.92 0 bottom
C31  14.92,32.38 0 bottom
C32  31.11,13.02 270 bottom
C37  68.26,33.02 0 bottom
C38  64.77,31.11 270 bottom
C39  68.26,25.4 0 bottom
C40  65.09,23.18 270 bottom
C41  39.05,21.27 180 bottom
C42  39.05,22.54 180 bottom
F1  39.05,35.88 0 bottom
F2  32.38,28.89 0 bottom
F3  35.24,25.08 0 bottom
HDMI_IN  93.98,17.78 180 bottom
HDMI_OUT  93.98,39.05 180 bottom
JX1  71.12,47.62 0 top
JX2  71.12,3.17 0 top
K1  0,24.45 180 bottom
L1  14.92,6.67 270 top
LED1  90.49,2.86 180 top
LED2  88.27,2.86 180 top
LED3  86.04,2.86 180 top
LED4  83.82,2.86 180 top
OFF  2.86,14.29 270 bottom
ON  2.86,10.79 270 bottom
PCA9306  85.09,28.57 270 bottom
R1  21.27,27.3 0 bottom
R2  24.77,27.3 0 bottom
R3  5.71,47.31 90 bottom
R4  13.65,49.21 270 bottom
R5  79.69,7.62 180 top
R6  79.69,6.03 180 top
R7  21.27,21.27 180 bottom
R8  98.74,27.94 0 bottom
R9  21.27,17.46 0 bottom
R10  24.77,25.72 180 bottom
R11  6.35,10.79 0 bottom
R12  6.35,14.29 180 bottom
R19  79.69,4.45 180 top
R20  79.69,2.86 180 top
R21  98.74,29.53 0 bottom
R22  89.53,24.13 90 bottom
R23  54.29,41.91 0 bottom
R24  35.88,26.35 0 bottom
R25  39.05,29.53 0 bottom
R26  35.24,31.43 0 bottom
R27  35.24,33.97 0 bottom
R28  39.05,34.61 0 bottom
R29  88.58,45.4 180 bottom
R30  74.93,25.08 0 bottom
R31  74.61,20.64 0 bottom
R32  88.58,43.18 180 bottom
RN3  89.22,20 0 bottom
RN4  86.68,18.73 0 bottom
RN5  83.82,17.14 0 bottom
RN6  80.96,15.56 0 bottom
RN7  81.28,25.72 90 bottom
U$1  8.57,13.97 180 bottom
U$2  8.89,45.09 270 bottom
U$3  8.89,49.21 270 bottom
U$4  59.69,21.27 0 bottom
U$5  20.95,34.29 270 bottom
U$6  67.94,30.48 270 bottom
U$7  25.08,22.23 90 bottom
U$8  25.08,18.41 90 bottom
U$11  20.95,43.18 270 bottom
U$14  67.94,23.18 270 bottom
U$15  35.24,22.23 0 bottom
U$17  74.61,22.86 90 bottom
U$18  35.56,15.88 270 bottom

### Tracks (layer width: path | path; a pad name or v marks a point on that pad's centre or on a via)
5V  (via drill 0.3)
  Top 0.508: JX1.P$43 54.29,48.65 v54.29,50.48 v54.29,51.44 54.29,53 JX1.P$44 54.32,55.12 C12.1 55.12,54.31 JX1.P$42 55.12,51.56 v55.24,51.44 v55.24,50.48 55.12,50.36 JX1.P$41 | JX2.P$44 54.32,7.01 v54.29,6.99 v54.29,6.03 54.32,6 JX2.P$43 54.32,2.04 C13.1 55.12,2.83 JX2.P$41 55.12,5.91 v55.24,6.03 v55.24,6.99 55.12,7.11 JX2.P$42 | JX2.P$89 35.92,5.99 v35.88,6.03
  Bottom 0.203: R9.2 v19.05,17.46
  Bottom 0.254: RN7.4 82.54,28.8 | 82.54,28.8 83.04,29.3 PCA9306.8 | PCA9306.7 82.54,28.8
  Bottom 0.305: HDMI_IN.18 91.57,21.78 91.12,22.23 91.12,26.67 v90.17,27.62 v90.17,28.57 | v77.47,46.04 v78.42,46.04 84.88,46.04 R32.1
  Bottom 0.508: RN7.4 77.08,26.92 v76.83,26.67 77.39,26.12 RN7.3 | 37.15,20.93 v37.15,20 v38.1,20 v39.05,20
  Bottom 0.61: C41.1 37.85,20.93 37.15,20.93 U$15.1 | C37.1 69.11,31.56 U$6.1 | C39.1 69.25,25.27 U$14.1
  Bottom 0.813: v76.83,33.02 v75.88,33.02 v74.93,33.02 C37.1 | v76.83,26.67 v75.88,26.67 v74.93,26.67 74.08,25.82 R30.2 73.76,25.4 C39.1
  other vias: 13.97,46.04 14.92,46.04 15.88,46.04 15.88,46.99 14.92,46.99 13.97,46.99 13.97,45.09 14.92,45.09 15.88,45.09 13.97,37.47 14.92,37.47 15.88,37.47 15.88,38.42 14.92,38.42 13.97,38.42 13.97,36.51 14.92,36.51 15.88,36.51 24.45,8.57 23.5,8.57 22.54,8.57 21.59,8.57 21.59,7.62 22.54,7.62 23.5,7.62 24.45,7.62 24.45,6.67 23.5,6.67 22.54,6.67 21.59,6.67 21.59,5.71 22.54,5.71 23.5,5.71 24.45,5.71 24.45,4.76 23.5,4.76 22.54,4.76 21.59,4.76 20.64,8.57 20.64,7.62 20.64,6.67 20.64,5.71 20.64,4.76 15.56,8.57 16.51,8.57 16.51,7.62 15.56,7.62 15.56,6.67 16.51,6.67 16.51,5.71 15.56,5.71 15.56,4.76 16.51,4.76
  pour Route15: 9.84,51.44 13.97,55.56 100.01,55.56 100.01,26.04 74.93,26.04 74.61,26.35 74.61,45.4 72.39,47.94 23.18,47.94 20.95,45.4 20.95,23.5 40.01,23.5 40.01,19.68 20.95,19.68 20.95,10.79 22.23,9.21 100.65,9.21 100.65,0.95 9.84,0.95
  pour Bottom: 19.05,44.77 19.05,45.72 18.41,46.35 18.41,47.31 16.83,48.9 13.02,48.9 13.02,45.09 13.34,44.77
  pour Bottom: 19.37,35.56 19.37,36.51 18.73,37.15 18.73,38.1 17.14,39.69 11.11,39.69 11.11,35.88 11.43,35.56
  pour Top: 15.56,9.21 25.08,9.21 25.08,4.13 15.56,4.13
5V_OFF  (via drill 0.3)
  Top 0.203: U$1.P$5 21.17,18.63 v22.23,19.68 22.23,23.5 v20.32,25.4
  Bottom 0.203: U$1.P$5 18.6,9.53 15.24,9.53 14.29,10.48 14.29,13.02 13.02,14.29 R12.2 | R7.2 22.23,21.27 | 22.23,21.27 U$7.1 | v22.23,19.68 22.23,21.27 | v20.32,25.4 20.32,27.2 R1.2
ADC_BIAS  (via drill 0.3)
  Top 0.61: v40.96,28.89 38.1,28.89 v36.83,27.62
  Bottom 0.61: R24.1 36.73,26.67 36.46,26.94 | 36.46,26.94 C23.2 | 36.46,26.94 36.46,27.25 v36.83,27.62 | v40.96,28.89 U$4.P$18
BIAS1
  Bottom 0.406: R28.1 C27.2 40.28,32.96 U$4.P$14
BIAS2
  Bottom 0.406: U$4.P$15 41.24,31.94 40.84,32.34 36.46,32.34 C26.2 R27.1
BIAS3
  Bottom 0.406: U$4.P$16 41.47,30.92 40.64,31.75 36.41,31.75 R26.1 C25.2
BIAS4
  Bottom 0.406: C24.2 R25.1 40.28,29.91 U$4.P$17
CLK  (via drill 0.3)
  Top 0.203: v64.45,26.99 58.74,32.7 58.74,35.56 47.92,46.38 JX1.P$59
  Bottom 0.203: U$4.P$5 64.33,26.86 v64.45,26.99
D0  (via drill 0.3)
  Top 0.203: v57.78,16.51 51.75,10.48 49.53,10.48 48.72,9.67 JX2.P$58
  Bottom 0.203: U$4.P$25 58.17,16.89 v57.78,16.51
D1  (via drill 0.3)
  Top 0.203: v56.83,16.51 51.44,11.11 48.9,11.11 47.92,10.14 JX2.P$60
  Bottom 0.203: U$4.P$26 57.15,16.83 v56.83,16.51
D2  (via drill 0.3)
  Top 0.203: v55.88,16.51 51.12,11.75 48.58,11.75 46.32,9.49 JX2.P$64
  Bottom 0.203: U$4.P$27 56.13,16.76 v55.88,16.51
D3  (via drill 0.3)
  Top 0.203: v54.93,16.51 50.8,12.38 48.26,12.38 45.52,9.64 JX2.P$66
  Bottom 0.203: U$4.P$28 55.12,16.7 v54.93,16.51
D4  (via drill 0.3)
  Top 0.203: v53.98,16.51 50.48,13.02 46.99,13.02 43.92,9.95 JX2.P$70
  Bottom 0.203: U$4.P$29 54.1,16.64 v53.98,16.51
D5  (via drill 0.3)
  Top 0.203: v50.8,16.51 47.94,13.65 46.35,13.65 43.12,10.42 JX2.P$72
  Bottom 0.203: U$4.P$32 51.05,16.76 v50.8,16.51
D6  (via drill 0.3)
  Top 0.203: v49.85,16.51 47.62,14.29 45.72,14.29 41.52,10.09 JX2.P$76
  Bottom 0.203: U$4.P$33 50.04,16.7 v49.85,16.51
D7  (via drill 0.3)
  Top 0.203: v48.9,16.51 47.31,14.92 45.4,14.92 40.72,10.24 JX2.P$78
  Bottom 0.203: U$4.P$34 49.02,16.64 v48.9,16.51
D8  (via drill 0.3)
  Top 0.203: JX2.P$82 39.05,8.64 39.05,9.53 45.09,15.56 46.99,15.56 v47.94,16.51
  Bottom 0.203: U$4.P$35 48.01,16.57 v47.94,16.51
D9  (via drill 0.3)
  Top 0.203: v46.99,16.51 46.67,16.19 44.45,16.19 38.32,10.06 JX2.P$84
  Bottom 0.203: U$4.P$36 v46.99,16.51
DET_CONTROL  (via drill 0.3)
  Top 0.203: v64.77,6.67 64.77,8.53 JX2.P$18
  Bottom 0.203: v64.77,6.67 64.77,12.38 73.03,20.64 R31.2 73.51,21.2 U$17.1
FRAME_VALID  (via drill 0.3)
  Top 0.203: v53.02,32.07 43.12,41.97 JX1.P$71
  Bottom 0.203: U$4.P$38 57.15,36.2 v53.02,32.07
GND  (via drill 0.3)  (8 unrouted)
  Top 0.508: LED4.C LED3.C LED2.C LED1.C 91.86,1.81 v92.08,1.59 v93.03,1.59 v93.98,1.59 | JX2.P$86 37.52,6.41 | 37.52,6.41 v37.47,6.35 | JX2.P$85 37.52,6.41 | JX2.P$79 39.92,6.12 v39.69,6.35 39.92,6.58 JX2.P$80 | JX2.P$74 42.32,6.44 v42.23,6.35 42.32,6.26 JX2.P$73 | JX2.P$67 44.72,6.3 | 44.72,6.3 v44.77,6.35 | JX2.P$68 44.72,6.3 | JX2.P$62 47.12,6.48 | 47.12,6.48 v46.99,6.35 | JX2.P$61 47.12,6.48 | JX2.P$56 v49.53,6.35 49.53,4.18 JX2.P$55 | JX2.P$50 51.92,6.52 v51.75,6.35 51.92,6.18 JX2.P$49 | JX2.P$36 57.52,6.4 | 57.52,6.4 v57.47,6.35 | JX2.P$35 57.52,6.4 | JX2.P$30 59.92,6.44 | 59.92,6.44 v60.01,6.35 | JX2.P$29 59.92,6.44 | JX2.P$24 62.32,6.44 v62.23,6.35 | JX2.P$15 65.52,5.92 | 65.52,5.92 v65.41,6.03 | JX2.P$16 65.52,6.99 65.53,6.98 65.53,6.35 65.52,6.34 65.52,5.92 | JX2.P$10 67.92,6.69 | 67.92,6.69 v67.94,6.67 | JX2.P$9 67.92,6.69 | JX1.P$86 37.52,51.06 v37.78,50.8 37.52,50.54 JX1.P$85 | JX1.P$79 39.92,50.72 | 39.92,50.72 v40.01,50.8 | JX1.P$80 39.92,50.72 | JX1.P$73 42.32,50.71 | 42.32,50.71 v42.23,50.8 | JX1.P$74 42.32,50.71 | JX1.P$68 44.72,50.85 | 44.72,50.85 v44.77,50.8 | JX1.P$67 44.72,50.85 | JX1.P$62 47.12,50.93 | 47.12,50.93 v46.99,50.8 | JX1.P$61 47.12,50.93 | JX1.P$56 v49.52,50.81 | v49.52,50.81 v49.53,50.8 | JX1.P$55 v49.52,50.81 | JX1.P$49 51.92,50.63 v51.75,50.8 51.92,50.97 JX1.P$50 51.92,54.67 C12.2 | JX1.P$30 59.92,50.89 v60.01,50.8 59.92,50.71 JX1.P$29 | JX1.P$36 57.52,50.85 | 57.52,50.85 v57.47,50.8 | JX1.P$35 57.52,50.85 | JX1.P$24 62.32,50.89 v62.23,50.8 | 65.52,50.91 JX1.P$16 65.52,54.71 C15.2 | 65.52,50.91 v65.41,50.8 | JX1.P$15 65.52,50.91 | JX1.P$6 69.52,51.1 v69.22,50.8 69.52,50.49 JX1.P$5 | JX1.P$4 70.32,50.95 v70.17,50.8 70.32,50.65 JX1.P$3
  Top 0.508: JX1.P$2 v71.12,50.8 JX1.P$1 | C13.2 v50.8,1.91 | v59.69,1.91 C14.2
  Bottom 0.254: v88.27,29.21 88.17,29.3 PCA9306.1
  Bottom 0.305: v94.93,42.55 HDMI_OUT.17 | HDMI_OUT.14 94.84,41.05 v94.93,40.96 | HDMI_OUT.11 94.75,39.55 v94.93,39.37 | HDMI_OUT.8 94.89,38.05 v94.93,38.1 | HDMI_OUT.5 94.89,36.55 v94.93,36.51 | HDMI_OUT.2 94.81,35.05 v94.93,34.92 | HDMI_IN.2 94.74,13.78 v94.93,13.97 | HDMI_IN.5 94.89,15.28 v94.93,15.24 | HDMI_IN.8 94.89,16.78 v94.93,16.83 | HDMI_IN.11 94.75,18.28 v94.93,18.1 | HDMI_IN.14 94.84,19.78 v94.93,19.68 | HDMI_IN.17 v94.92,21.28 v94.93,21.27
  Bottom 0.508: v53.34,36.2 53.09,36.45 U$4.P$42 53.09,40.28 C22.1 | v54.29,36.2 54.1,36.39 U$4.P$41 | U$4.P$44 51.05,40.07 v50.8,40.32 | v65.09,25.4 C39.2 67.94,24.87 v67.94,23.18 U$14.2 | v61.59,21.91 v62.55,21.91 | v62.55,21.91 v63.5,21.91 64.98,21.91 C40.2 | U$4.P$1 62.48,21.97 v62.55,21.91 | U$4.P$9 64.11,30.92 C38.2 64.77,29.21 v64.45,28.57 v65.41,28.57 | C37.2 67.94,32.49 v67.94,30.8 | v67.94,30.8 68.26,30.48 U$6.2 | v67.94,30.8 v67.94,29.84 | 39.81,21.18 C41.2 39.9,21.91 | U$18.P$3 | 39.9,21.91 C42.2 40.16,22.8 U$4.P$24 | v40.32,18.73 38.86,18.73 U$18.P$3 | v40.32,17.46 38.61,17.46 U$18.P$3 | v41.91,21.91 v40.96,21.91 39.9,21.91 | 42.61,24.77 U$4.P$22 40.47,24.83 C4.2 | v35.24,19.68 U$15.2 v35.24,22.23 | v35.24,19.68 v34.29,19.68 | v34.29,22.23 v35.24,22.23 | v35.24,22.23 v36.2,22.23 | v36.2,19.68 v35.24,19.68 | C5.2 40.35,26.86 U$4.P$20
  Bottom 0.61: C28.2 v93.34,29.53 v92.39,29.53 | C21.2 v93.34,27.94 v92.39,27.94 | v99.69,29.53 R21.1 | v99.69,27.94 R8.1 | v86.68,45.4 R29.1
  other vias: 34.29,30.16 33.97,27.62 38.1,30.8 38.1,37.15 38.1,33.34 34.29,32.7 67.94,24.13 66.04,25.4 67.94,31.75 14.29,29.84 14.29,28.89 14.29,27.94 14.29,26.99 13.34,26.99 13.34,27.94 13.34,28.89 13.34,29.84 12.38,29.84 12.38,28.89 12.38,27.94 12.38,26.99 12.38,26.04 12.38,25.08 12.38,24.13 12.38,23.18 11.43,23.18 11.43,24.13 11.43,25.08 11.43,26.04 10.48,26.04 10.48,25.08 10.48,24.13 10.48,23.18 14.29,22.23 14.29,21.27 14.29,20.32 14.29,19.37 13.34,19.37 13.34,20.32 13.34,21.27 13.34,22.23 12.38,22.23 12.38,21.27 12.38,20.32 12.38,19.37 46.35,21.27 47.31,21.27 48.26,21.27 49.21,21.27 50.16,21.27 51.12,21.27 52.07,21.27 54.29,21.27 55.24,21.27 56.2,21.27 57.15,21.27 58.1,21.27 59.05,21.27 46.35,24.45 47.31,24.45 48.26,24.45 49.21,24.45 50.16,24.45 51.12,24.45 52.07,24.45 46.35,22.86 47.31,22.86 48.26,22.86 49.21,22.86 50.16,22.86 51.12,22.86 52.07,22.86 54.29,24.45 55.24,24.45 56.2,24.45 57.15,24.45 58.1,24.45 59.05,24.45 60.01,24.45 54.29,22.86 55.24,22.86 56.2,22.86 57.15,22.86 58.1,22.86 59.05,22.86 60.01,22.86 62.23,20.95 63.18,20.95 64.14,20.95 64.45,21.91 65.09,20.95 46.35,26.99 47.31,26.67 48.26,26.99 49.21,26.67 50.16,26.99 51.12,26.67 52.07,26.99 53.02,26.67 53.98,26.99 54.93,26.67 55.88,26.99 56.83,26.67 57.78,26.99 66.04,20.95 66.99,20.95 67.94,21.27 67.94,22.23 66.36,28.57 67.31,28.57 21.59,35.56 21.59,34.61 21.59,33.66 21.59,32.7 20.64,32.7 20.64,33.66 20.64,34.61 20.64,35.56 21.59,44.45 21.59,43.5 21.59,42.55 21.59,41.59 20.64,41.59 20.64,42.55 20.64,43.5 20.64,44.45 31.11,12.06 96.52,42.55 96.52,40.96 96.52,39.37 96.52,38.1 96.52,36.51 96.52,34.92 98.11,42.55 98.11,40.96 98.11,39.37 98.11,38.1 98.11,36.51 98.11,34.92 99.69,42.55 99.69,40.96 99.69,39.37 99.69,38.1 99.69,36.51 99.69,34.92 96.52,21.27 96.52,19.68 96.52,18.1 96.52,16.83 96.52,15.24 96.52,13.97 98.11,21.27 98.11,19.68 98.11,18.1 98.11,16.83 98.11,15.24 98.11,13.97 99.69,13.97 99.69,15.24 99.69,16.83 99.69,18.1 99.69,19.68 99.69,21.27 73.34,23.81
  pour Bottom (rank 6): 0,50.8 26.99,50.8 28.57,49.21 28.57,10.79 27.3,9.53 0,9.53
  pour Route2: 0,57.15 101.6,57.15 101.6,0.32 0.32,0.32 0.32,56.83
  pour Bottom: 97.79,49.53 100.97,49.53 100.97,8.57 100.65,8.26 94.61,8.26 94.61,49.21 94.93,49.53 97.47,49.53
  pour Bottom (isolate 0.152, no thermals): 41.59,27.3 52.7,27.3 54.61,29.21 63.5,29.21 63.5,27.94 58.42,27.94 58.42,25.4 63.5,25.4 63.5,24.45 60.96,24.45 60.64,24.13 60.64,21.91 59.05,20.32 52.7,20.32 52.39,20 52.39,17.14 51.75,17.14 51.75,20 51.44,20.32 46.35,20.32 45.09,21.59 45.09,24.45 41.59,24.45
  pour Bottom: 61.28,23.18 64.77,23.18 64.77,26.04 69.22,26.04 69.22,20.64 62.23,20.64 61.28,21.59
  pour Bottom: 61.28,30.48 64.14,30.48 64.14,28.26 68.58,28.26 68.58,33.66 66.67,33.66 66.67,31.43 61.28,31.43
HDMI_OSC  (via drill 0.3)
  Top 0.203: v52.7,5.71 52.72,5.7 JX2.P$47
  Bottom 0.203: U$18.P$4 45.91,13.78 52.7,6.99 v52.7,5.71
HDMI_PU
  Bottom 0.305: RN6.3 RN6.4 83.05,17.84 RN5.3 RN5.4 85.91,19.43 RN4.3 RN4.4 88.45,20.7 RN3.3 RN3.4 89.72,23.1 R22.1
INT_TIME1  (via drill 0.3)
  Top 0.203: JX1.P$65 45.52,42.23 45.52,42.11 49.21,38.42 54.61,33.02 56.77,33.02 v56.83,32.96
  Bottom 0.203: U$4.P$11 v56.83,32.96
INT_TIME2  (via drill 0.3)
  Top 0.203: JX1.P$63 46.35,48.59 46.35,42.23 54.61,33.97 v56.83,33.97
  Bottom 0.203: v56.83,33.97 U$4.P$12
INT_TIME3  (via drill 0.3)
  Top 0.203: v53.98,32.07 47.78,38.26 43.92,42.12 JX1.P$69
  Bottom 0.203: U$4.P$37 58.1,38.23 58.1,36.2 v53.98,32.07
LED1
  Top 0.203: R20.2 77.25,1.27 65.09,1.27 63.92,2.44 JX2.P$19
LED2
  Top 0.203: R19.2 76.02,1.63 65.41,1.63 64.72,2.31 JX2.P$17
LED3
  Top 0.203: R6.2 74.79,1.98 66.99,1.98 66.32,2.65 JX2.P$13
LED4
  Top 0.203: R5.2 73.56,2.34 67.63,2.34 67.12,2.84 JX2.P$11
LINE_VALID  (via drill 0.3)
  Top 0.203: v52.07,32.07 41.52,42.62 JX1.P$75
  Bottom 0.203: U$4.P$39 56.13,36.13 v52.07,32.07
LPOWEN  (via drill 0.3)
  Top 0.203: 35.92,51.8 34.92,50.8 32.07,50.8 30.48,49.21 30.48,36.83 26.04,32.38 | 26.04,32.38 v25.72,32.38 | 26.04,32.38 26.04,27.94 v33.02,20.95 42.55,20.95 43.61,22.02 60.21,22.02 62.23,20 68.26,20 v69.85,21.59 69.85,27.94 v69.22,28.57
  Top 0.406: JX1.P$90 35.92,51.8
  Bottom 0.406: v25.72,32.38 U$5.4 | v33.02,20.95 34.26,20.95 U$15.3 | v69.85,21.59 69.85,21.62 U$14.3 | v69.22,28.57 U$6.3
N$1  (via drill 0.3)
  Top 0.203: v12.06,47.31 12.06,35.88 19.37,28.57 v22.23,28.57
  Bottom 0.203: R2.2 R1.1 22.23,27.41 v22.23,28.57 | U$2.1 12.28,46.03 C3.1 v12.06,47.31
N$2
  Bottom 0.203: F2.2 31.75,28.89
  Bottom 0.61: U$5.1 28.89,36.2 | 28.89,36.2 36.91,36.2 37.1,36.01 37.15,36.01 37.27,35.88 F1.2 | 28.89,36.2 31.75,33.34 31.75,28.89 31.75,26.99 33.66,25.08 F3.2 | C6.1 U$5.1 | U$5.1 U$5.2
N$3
  Top 0.203: R5.1 88.9,7.62 90.49,6.03 LED1.A
N$4
  Bottom 0.203: U$3.1 13.23,50.16 R4.1
N$5
  Bottom 0.203: R11.2 ON.A
N$6  (1 unrouted)
  Bottom 1.016: HDMI_OUT.SH2 94.58,31.45 HDMI_OUT.SH1 97.89,30.46 R21.2 C28.1 | HDMI_OUT.SH4 94.58,47.15 HDMI_OUT.SH3
N$7
  Top 1.778: U$1.P$3 11.54,11.99 L1.1
  Bottom 0.203: U$1.P$3 8.51,12.1 R11.1
N$8
  Bottom 0.203: R9.1 U$8.1
N$10
  Bottom 0.61: U$11.7 C16.1
N$11
  Bottom 0.61: C17.1 U$11.5 U$11.6
N$12
  Bottom 0.508: U$11.3 25.61,42.55 C18.1
N$13
  Top 0.203: R6.1 81.28,6.03 82.51,7.26 87.03,7.26 88.27,6.03 LED2.A
N$14
  Bottom 0.61: U$5.3 C7.1
N$15
  Top 0.203: R19.1 82.45,6.35 85.41,6.35 86.04,5.71 LED3.A
N$16
  Top 0.203: R20.1 80.86,3.17 81.6,3.17 82.33,3.91 LED4.A
N$17
  Bottom 0.305: HDMI_OUT.19 91.28,43.55 R29.2
N$18  (via drill 0.3)
  Top 0.203: v76.83,22.86 79.69,20 90.6,20 91.04,19.57 91.64,19.57 93.03,20.95 v93.03,23.18
  Bottom 0.203: U$17.3 v76.83,22.86 | v93.03,23.18 HDMI_IN.19
  Bottom 0.305: R30.1 75.78,22.93 U$17.3
N$19  (via drill 0.3)
  Top 0.203: v83.19,27.3 83.19,26.35 88.9,20.64 v90.49,20.64
  Bottom 0.203: RN7.5 82.79,27.8 PCA9306.5 83.19,27.43 v83.19,27.3 | v90.49,20.64 90.63,20.78 HDMI_IN.16
N$20  (via drill 0.3)
  Top 0.203: v84.45,26.99 84.45,25.72 88.93,21.25 91.06,21.25 91.41,20.89 91.41,20.37 v91.29,20.17
  Bottom 0.203: RN7.6 83.58,26.12 v84.45,26.99 84.45,27.94 84.09,28.3 PCA9306.6 | v91.29,20.17 91.72,20.28 HDMI_IN.15
N$21
  Bottom 0.305: HDMI_OUT.18 89.56,43.05 R32.2
N$22
  Bottom 0.61: U$5.7 C30.1
N$23
  Bottom 0.61: C31.1 U$5.5 U$5.6
N$24
  Bottom 0.203: R12.1 OFF.A
N$34  (1 unrouted)
  Bottom 1.016: HDMI_IN.SH3 94.58,25.88 HDMI_IN.SH4 97.89,26.87 R8.2 C21.1 | HDMI_IN.SH1 94.58,10.18 HDMI_IN.SH2
P1_CLOCK+  (via drill 0.3)
  Top 0.203: v88.72,19.36 88.58,19.36 88.3,19.09 79.23,19.09 75.79,15.65 58.51,15.65 52.7,9.84 52.72,9.83 JX2.P$48
  Bottom 0.203: HDMI_IN.10 92.07,17.78 91.83,18.02 91.83,18.03 91.43,18.42 89.74,18.42 88.86,19.3 RN3.2 v88.72,19.36
P1_CLOCK-  (via drill 0.3)
  Top 0.203: v89.73,19.32 89.15,18.73 79.38,18.73 75.88,15.24 58.74,15.24 53.52,10.02 JX2.P$46
  Bottom 0.203: HDMI_IN.12 90.24,18.78 RN3.1 v89.73,19.32
P1_DATA0+  (via drill 0.3)
  Top 0.203: RN4.2 85.98,18.03 85.45,17.5 79.55,17.5 76.05,14.01 60.05,14.01 55.92,9.88 JX2.P$40
  Bottom 0.203: HDMI_IN.7 91.67,16.28 91.12,16.83 87.31,16.83 86.18,17.96 RN4.2
  other vias: 86.18,18.03
P1_DATA0-  (via drill 0.3)
  Top 0.203: RN4.1 86.29,17.14 79.69,17.14 76.2,13.65 60.33,13.65 56.72,10.05 JX2.P$38
  Bottom 0.203: HDMI_IN.9 88.06,17.28 87.31,18.03 RN4.1
  other vias: 87.18,18.03
P1_DATA1+  (via drill 0.3)
  Top 0.203: RN5.2 82.87,15.99 82.87,15.91 80.05,15.91 76.56,12.42 61.32,12.42 58.32,9.43 JX2.P$34
  Bottom 0.203: HDMI_IN.4 91.58,14.78 90.94,15.42 84.16,15.42 83.14,16.45 RN5.2
  other vias: 83.32,16.45
P1_DATA1-  (via drill 0.3)
  Top 0.203: RN5.1 83.43,15.56 80.27,15.56 76.78,12.06 61.59,12.06 59.12,9.59 JX2.P$32
  Bottom 0.203: HDMI_IN.6 84.98,15.78 RN5.1
  other vias: 84.32,16.45
P1_DATA2+  (via drill 0.3)
  Top 0.203: RN6.2 80.46,14.42 76.87,10.83 62.08,10.83 60.72,9.47 JX2.P$28
  Bottom 0.203: HDMI_IN.1 92.93,13.38 91.83,13.38 91.28,13.93 81.39,13.93 RN6.2
  other vias: 80.46,14.86
P1_DATA2-  (via drill 0.3)
  Top 0.203: RN6.1 77.08,10.48 62.23,10.48 61.52,9.77 JX2.P$26
  Bottom 0.203: HDMI_IN.3 91.43,14.28 91.42,14.29 81.92,14.29 81.46,14.74 RN6.1
  other vias: 81.46,14.86
P2_CLOCK+  (via drill 0.3)
  Top 0.203: v81.28,39.37 80.01,39.37 79.41,39.97 57.51,39.97 50.32,47.15 JX1.P$53
  Bottom 0.203: HDMI_OUT.10 91.76,39.05 91.12,39.69 82.23,39.69 81.92,39.37 v81.28,39.37
P2_CLOCK-  (via drill 0.3)
  Top 0.203: v80.33,40.32 57.78,40.32 51.12,46.99 JX1.P$51
  Bottom 0.203: HDMI_OUT.12 81.64,40.05 81.38,40.32 v80.33,40.32
P2_DATA0+  (via drill 0.3)
  Top 0.203: v83.82,38.1 80.37,41.55 58.78,41.55 52.72,47.61 JX1.P$47
  Bottom 0.203: HDMI_OUT.7 91.67,37.55 91.12,38.1 v83.82,38.1
P2_DATA0-  (via drill 0.3)
  Top 0.203: JX1.P$45 53.52,47.45 59.05,41.91 80.96,41.91 v83.82,39.05
  Bottom 0.203: v83.82,39.05 84.32,38.55 HDMI_OUT.9
P2_DATA1+  (via drill 0.3)
  Top 0.203: JX1.P$39 55.92,47.66 55.88,47.62 60.73,42.77 81.19,42.77 87.76,36.2 v87.95,36.2
  Bottom 0.203: HDMI_OUT.4 91.58,36.05 91.12,36.51 88.27,36.51 v87.95,36.2
P2_DATA1-  (via drill 0.3)
  Top 0.203: JX1.P$37 56.72,47.42 60.96,43.18 81.6,43.18 87.63,37.15 v87.95,37.15
  Bottom 0.203: HDMI_OUT.6 92.94,37.15 v87.95,37.15
P2_DATA2+  (via drill 0.3)
  Top 0.203: v91.12,34.61 90.17,35.56 90.17,35.82 81.58,44.41 61.45,44.41 58.23,47.62 58.1,47.62 58.1,48.41 JX1.P$33
  Bottom 0.203: HDMI_OUT.1 91.44,34.55 91.39,34.61 v91.12,34.61
P2_DATA2-  (via drill 0.3)
  Top 0.203: v91.12,35.56 81.92,44.77 61.59,44.77 59.05,47.31 59.12,47.37 JX1.P$31
  Bottom 0.203: HDMI_OUT.3 v91.12,35.56
PRECHARGE_BIAS
  Bottom 0.508: U$4.P$40 55.12,40.62 C22.2 R23.1
PWR_EN  (via drill 0.3)
  Top 0.203: v33.02,54.93 33.52,54.43 JX1.P$96
  Bottom 0.203: U$3.3 U$2.3 | R3.2 6.77,49.21 U$3.3 | U$3.3 7.79,51.29 11.43,54.93 v33.02,54.93
RESET  (via drill 0.3)
  Top 0.203: JX1.P$77 40.72,41.83 54.61,27.94 v58.74,27.94
  Bottom 0.203: v58.74,27.94 62.42,27.94 U$4.P$6
SCL2  (via drill 0.3)
  Top 0.203: v66.99,6.03 67.12,6.16 JX2.P$12
  Bottom 0.203: PCA9306.3 87.27,28.3 87.63,27.94 87.63,27.62 84.53,24.52 RN7.8 81.91,23.17 75.56,16.83 70.48,16.83 66.99,13.34 v66.99,6.03
SCLC  (via drill 0.3)
  Top 0.203: U$18.P$2 34.41,16.83 33.34,16.83 32.7,17.43 24.73,25.41 24.73,34.76 28.85,38.88 28.85,48.74 27.55,50.05 27.55,51.6 31.86,55.92 37.93,55.92 39.12,54.73 JX1.P$82
  other vias: 35.56,17.98
SDA2  (via drill 0.3)
  Top 0.203: v66.35,6.67 66.35,8.54 JX2.P$14
  Bottom 0.203: PCA9306.4 84.12,25.32 RN7.7 81.61,25.02 81.47,25.02 81.28,24.83 81.28,23.18 75.29,17.18 70.34,17.18 66.36,13.2 66.36,6.99 v66.35,6.67
SDAC  (via drill 0.3)
  Top 0.203: U$18.P$1 25.08,25.91 25.08,34.61 29.21,38.73 29.21,48.89 27.9,50.2 27.9,51.45 32.01,55.56 37.78,55.56 38.32,55.02 JX1.P$84
  other vias: 33.02,17.98
SPI_CLK  (via drill 0.3)
  Top 0.203: v46.67,32.7 36.72,42.66 JX1.P$87
  Bottom 0.203: U$4.P$47 48.01,34.04 v46.67,32.7
SPI_DATA  (via drill 0.3)
  Top 0.203: JX1.P$83 38.32,43.81 38.32,43.59 38.32,42.33 v47.94,32.7
  Bottom 0.203: U$4.P$46 49.02,33.78 v47.94,32.7
SPI_EN  (via drill 0.3)
  Top 0.203: JX1.P$89 35.92,42.23 35.92,42.19 v45.4,32.7
  Bottom 0.203: U$4.P$48 46.99,34.29 v45.4,32.7
VADC
  Bottom 0.203: 42.55,25.72 U$4.P$21
  Bottom 0.508: R24.2 36.12,25.26 F3.1 C4.1 39.43,25.99 40.94,25.99 41.08,25.84 U$4.P$21
  Bottom 0.61: U$4.P$21 53.02,25.84 | 53.02,25.84 U$4.P$4 | U$4.P$30 53.09,25.78 53.02,25.84
VCCIO  (via drill 0.3)
  Top 0.508: JX1.P$23 62.32,47.08 v62.23,46.99 v62.23,46.04 | v63.18,46.04 v63.18,46.99 63.12,47.05 JX1.P$21 JX1.P$22 63.12,55.08 C15.1 | JX2.P$22 63.12,6.73 v63.18,6.67 | 63.12,5.65 JX2.P$21 63.12,1.95 C14.1 | 63.12,5.65 v63.18,5.71 | JX2.P$23 62.32,4.85 63.12,5.65
  Bottom 0.254: v87.63,23.81 v87.63,24.77 88.01,25.15 | PCA9306.2 87.4,28.8 88.01,28.19 88.01,25.15 | 88.01,25.15 89.37,25.15 R22.2
  Bottom 0.508: RN7.2 79.29,25.32 v78.74,24.77 | RN7.1 79.44,24.52 v78.74,23.81 78.74,22.86 76.52,20.64 R31.1 | v32.7,10.48 v32.7,11.43 32.7,13.46 U$18.P$6 | v33.66,10.48 v33.66,11.43 33.02,12.06 U$18.P$6 | U$4.P$43 52.07,36.2 51.75,35.88 50.48,35.88 50.04,36.32 U$4.P$45 50.04,40.13 v49.85,40.32 v49.21,40.96 | v63.18,18.73 v63.18,17.78 v63.18,16.83 v63.18,6.67 v63.18,5.71 | U$18.P$6 31.21,13.78 C32.1
  other vias: 26.04,46.67 26.04,45.72 26.04,44.77 27.94,46.67 27.94,45.72 27.94,44.77 26.99,46.67 26.99,45.72 26.99,44.77 26.04,43.81 26.99,43.81 27.94,43.81 27.94,42.86 26.99,42.86 26.99,41.91 27.94,41.91 27.94,40.96 26.99,40.96 26.99,40.01 27.94,40.01 27.94,39.05 26.99,39.05
  pour Bottom: 23.5,43.5 26.35,43.5 26.35,38.42 27.94,38.42 28.57,39.05 28.57,47.31 23.5,47.31
  pour Route15: 25.4,47.31 70.8,47.31 73.34,44.45 73.34,25.4 100.01,25.4 100.01,9.84 30.48,9.84 30.48,19.05 40.64,19.05 40.64,24.13 25.4,24.13
VCCIO_EN  (via drill 0.3)
  Top 0.203: JX2.P$91 35.12,2.1 34.61,1.59 27.94,1.59 26.04,3.49 v26.04,16.51 | v22.86,25.72 22.86,38.73 v24.13,40.01
  Bottom 0.203: v26.04,16.51 26.18,16.66 U$8.3 U$7.3 26.18,23.66 25.4,24.45 24.45,24.45 24.13,24.77 24.13,25.5 R10.1 v22.86,25.72 | v24.13,40.01 24.13,41.17 U$11.4
VDDA
  Bottom 0.508: 37.57,28.9 38.52,27.95 | 38.52,27.95 C5.1 | 38.52,27.95 42.6,27.95 U$4.P$19
  Bottom 0.61: U$4.P$19 52.32,27.88 54.36,29.91 U$4.P$8 | 33.34,31.11 33.34,28.97 F2.1 37.46,28.89 37.46,28.9 37.57,28.9 R25.2 | 33.34,31.11 33.66,31.43 R26.2 | R27.2 33.66,33.97 33.34,33.66 | 33.34,33.66 33.34,31.11 | R28.2 37.47,34.61 36.83,35.24 33.97,35.24 33.34,34.61 33.34,33.66
VDDD
  Bottom 0.61: U$4.P$10 64.75,31.94 C38.1 66.11,31.96 U$6.5
VDDD1
  Bottom 0.61: U$15.5 36.48,23.81 38.42,23.81 | U$4.P$23 38.42,23.81 | C42.1 38.2,23.6 38.42,23.81
VDDO
  Bottom 0.61: U$4.P$2 64.98,23.81 C40.1 65.5,24.13 U$14.5
VIN
  Bottom 1.27: U$1.P$4 16.56,23.98 K1.1
VPIX
  Bottom 0.508: R23.2 47.94,41.91 41.91,35.88 40.96,35.88
  Bottom 0.61: C20.1 39.93,37.12 F1.1 40.96,35.88 41.59,35.88 42.67,34.8 U$4.P$13

### Text on the board
bNames: LUPA300 HDMI FPGA Interface / / University of Kentucky / Matt Ruffner / 2018